# Altium project mixed_audio_board.PrjPcb (part 1 of 2)
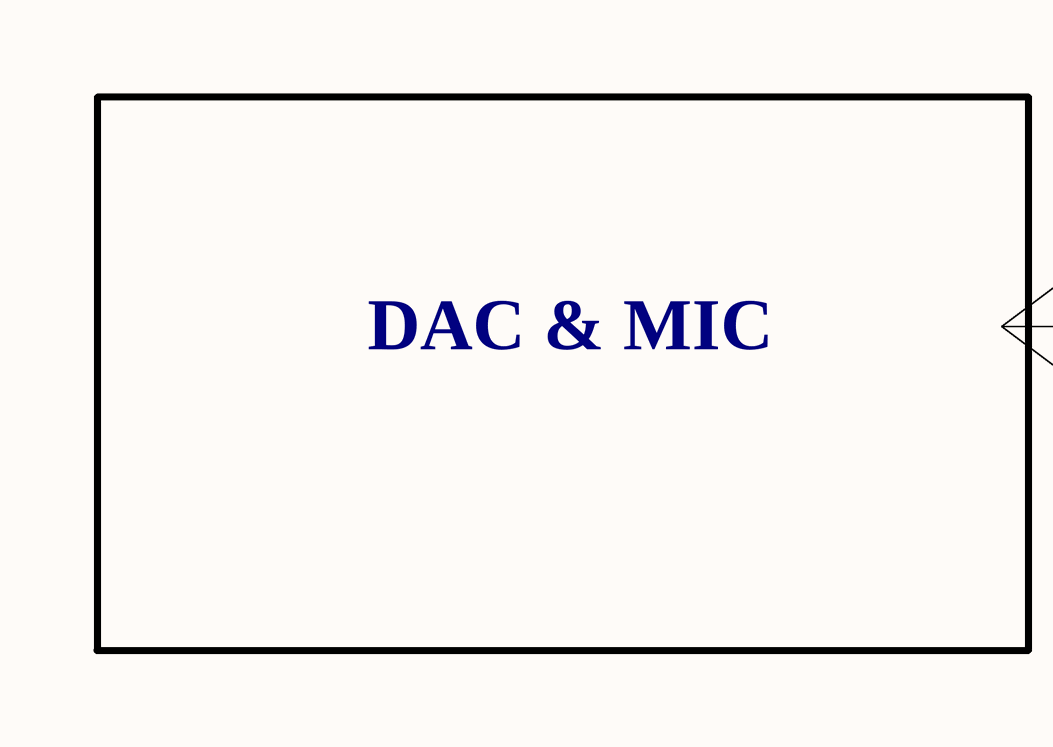
[diagram p0: [1]block_diagram.SchDoc, top left]
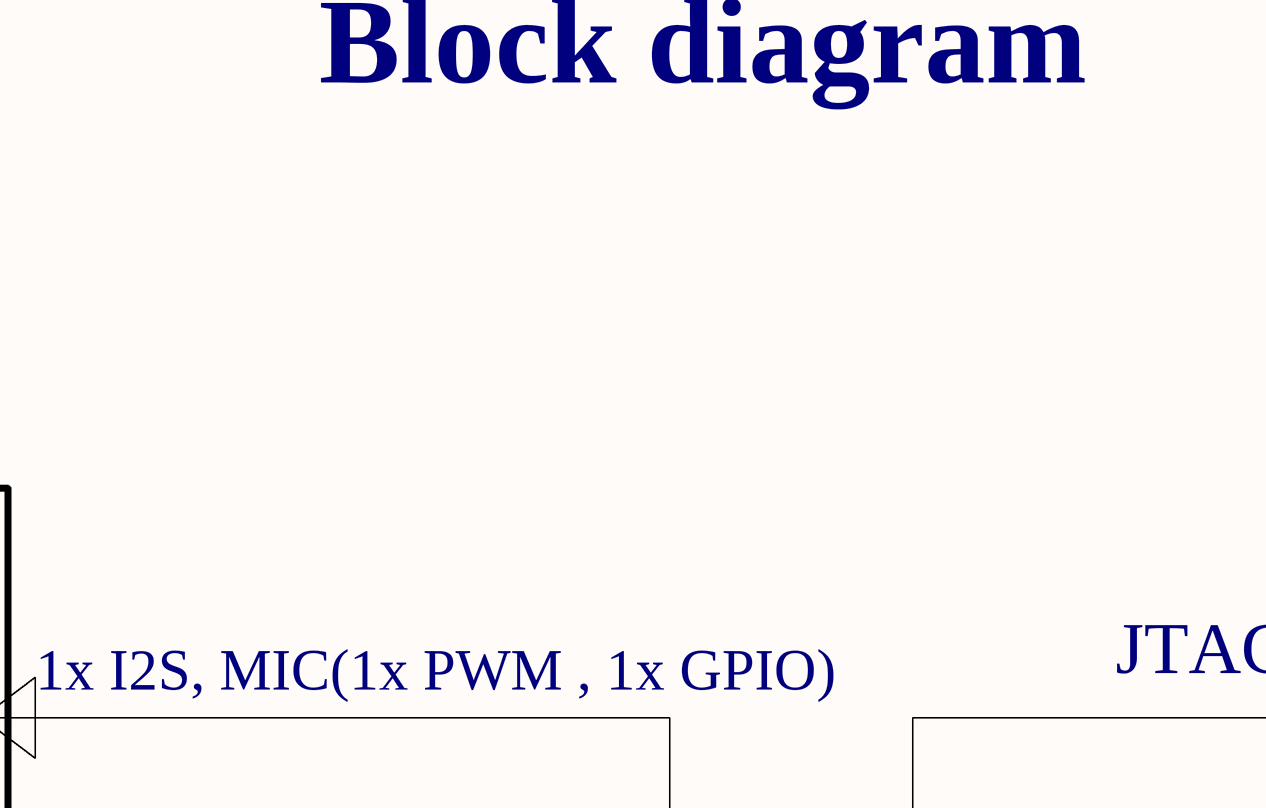
[diagram p1: [1]block_diagram.SchDoc, top middle]
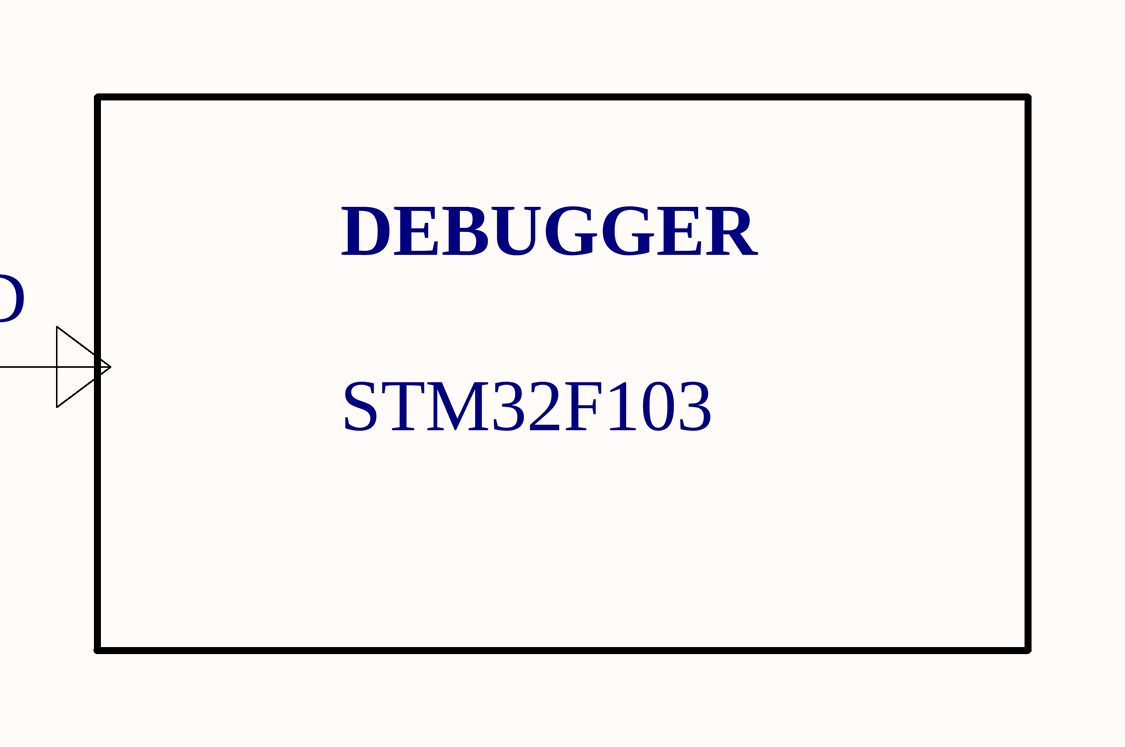
[diagram p2: [1]block_diagram.SchDoc, top right]
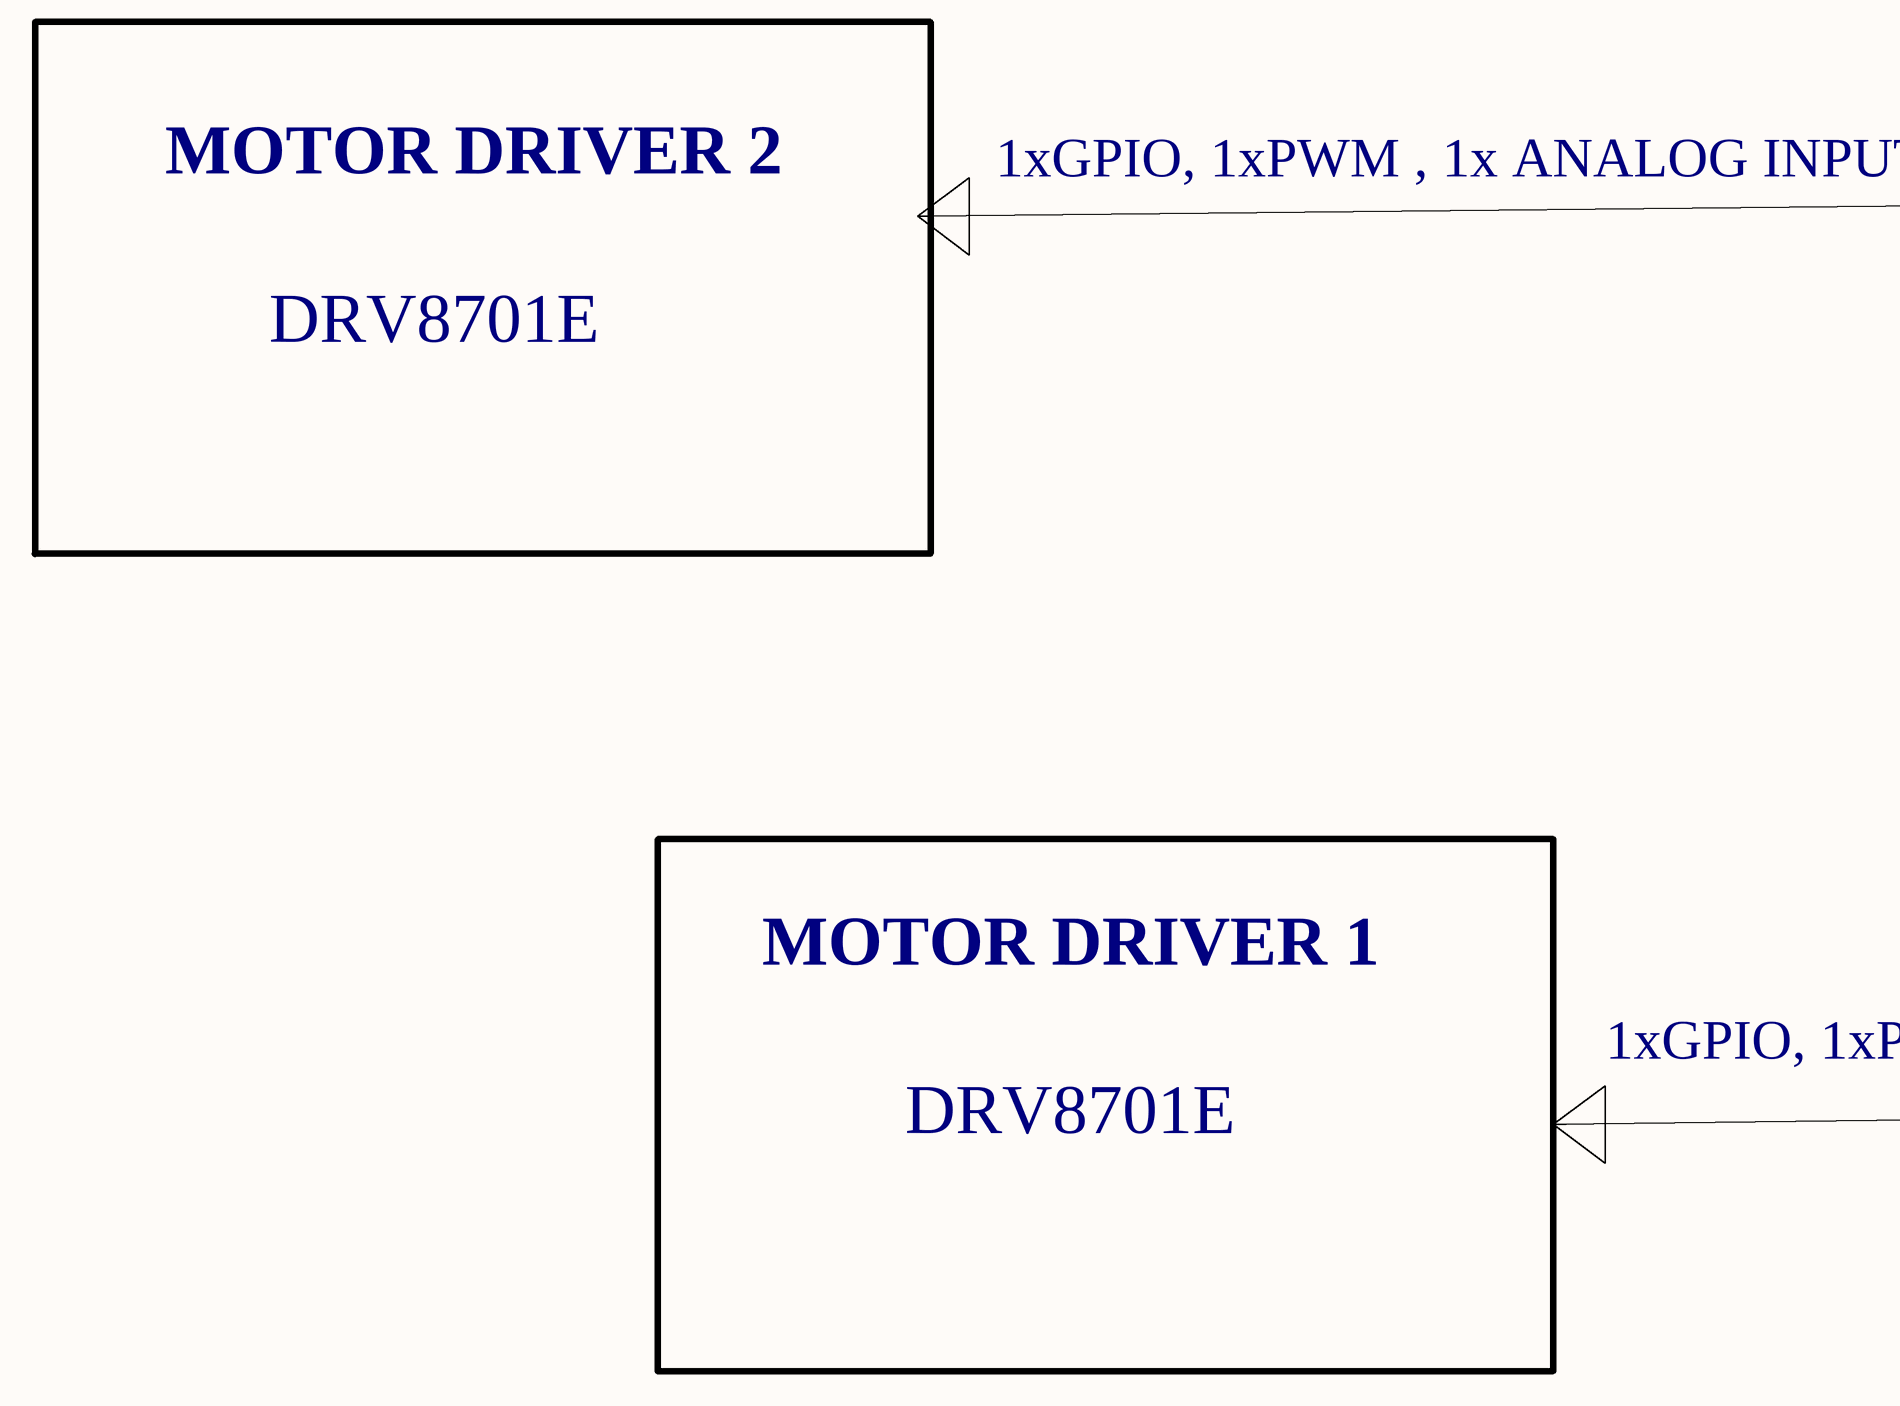
[diagram p3: [1]block_diagram.SchDoc, bottom left]
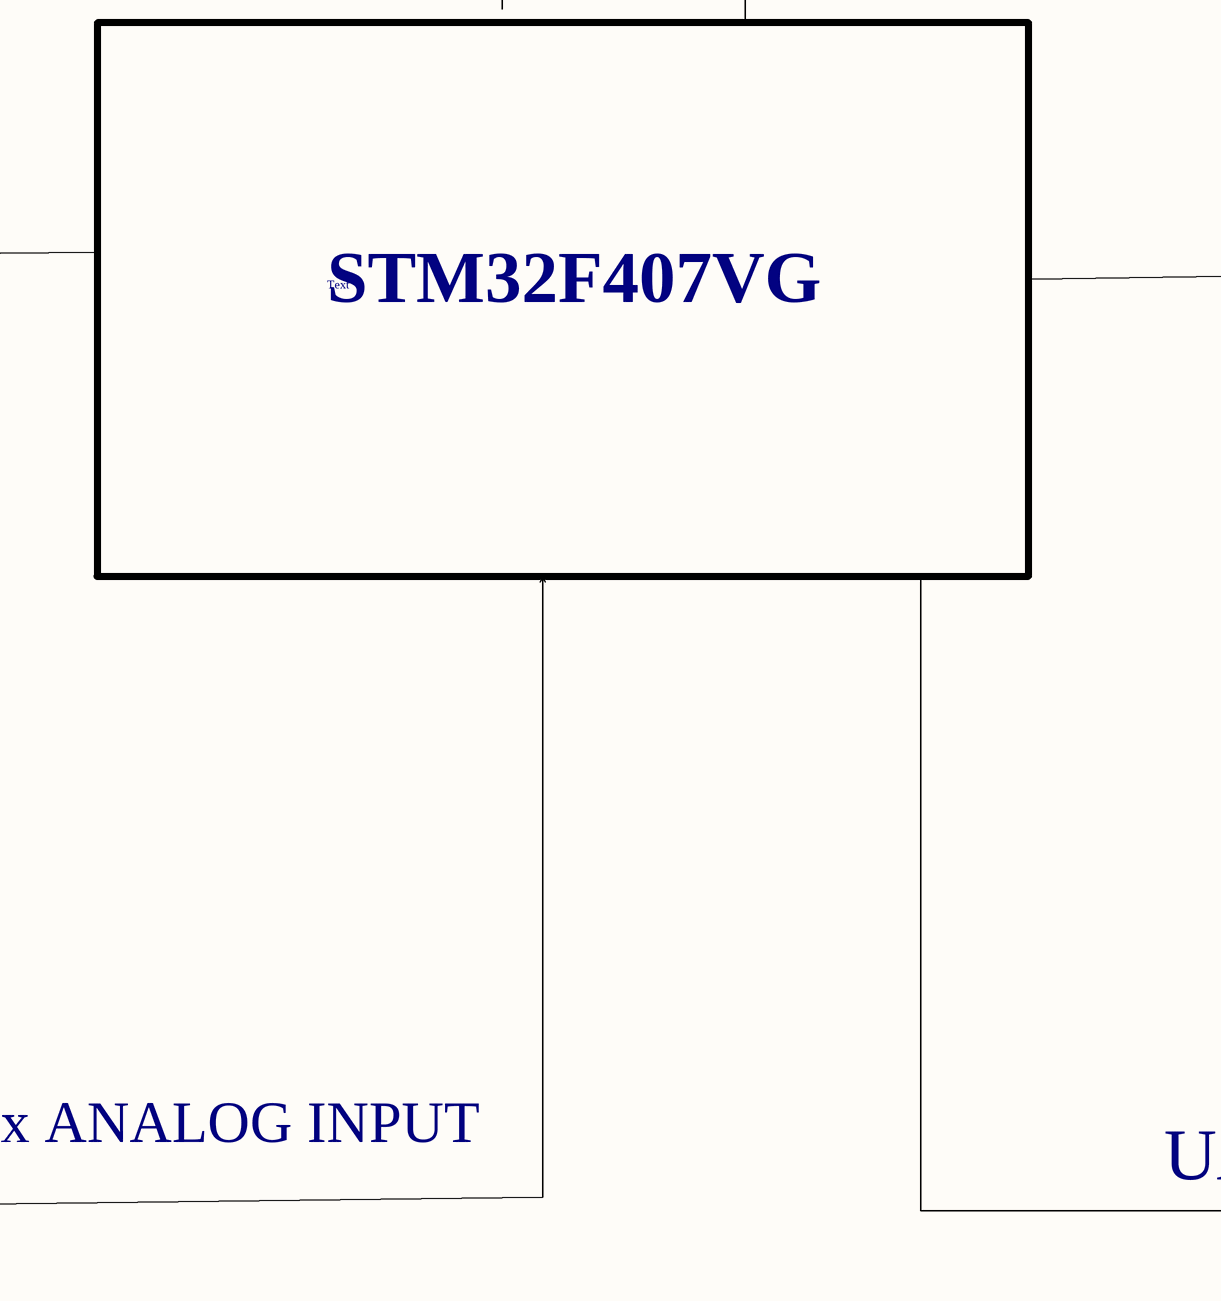
[diagram p4: [1]block_diagram.SchDoc, bottom middle]
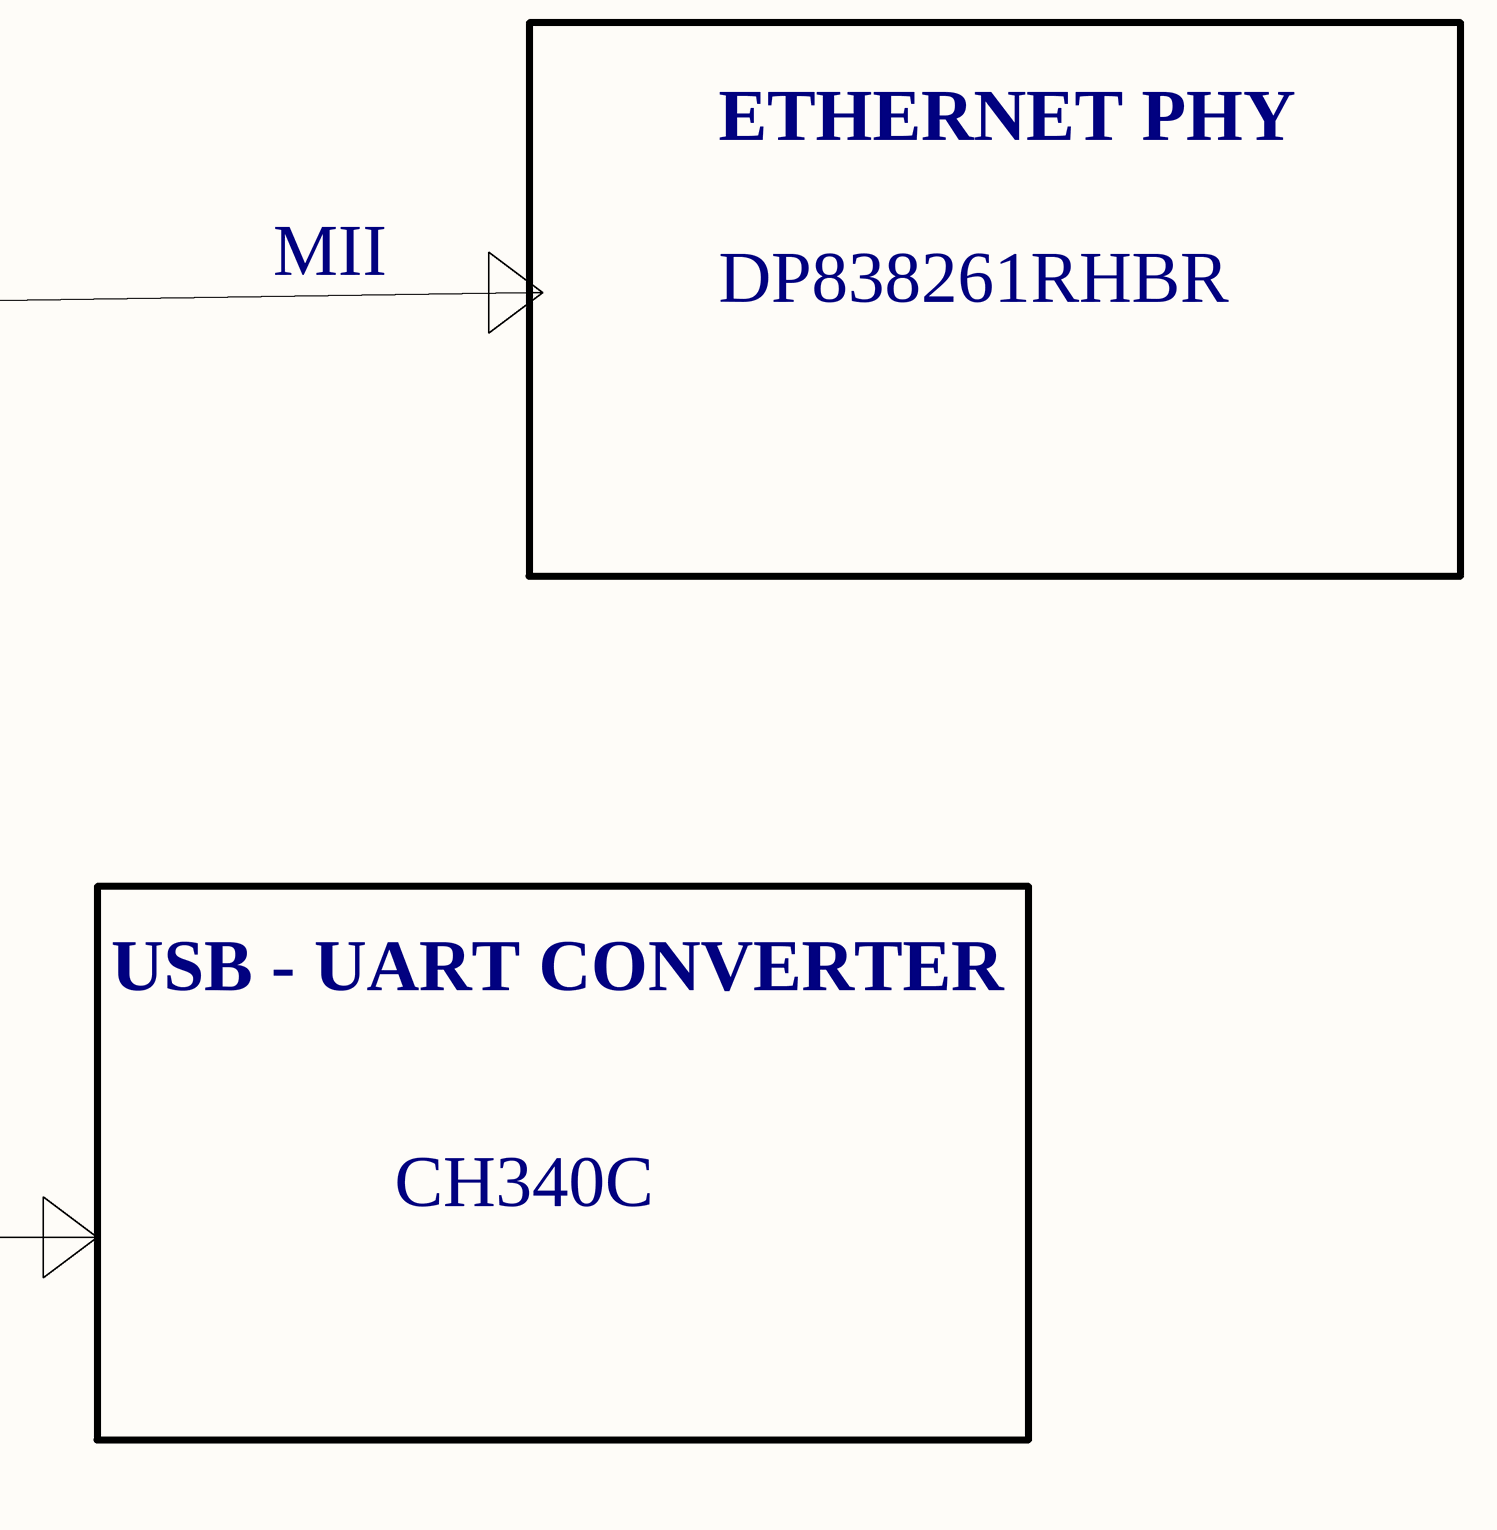
[diagram p5: [1]block_diagram.SchDoc, bottom right]
11 sheets, 188 parts. Net scope: flat (ports and power ports of the same name join across sheets).
Board file: mixed_audio_board.PcbDoc
Sheets:
  [1]block_diagram.SchDoc
  [2]Power_budget.SchDoc
  [3]STM32F103_Debugger.SchDoc
  [4]Ethernet_PHY.SchDoc
  [5]Motor_Driver.SchDoc
  [6]CH340C.SchDoc
  [7]DAC_and_MIC.SchDoc
  [8]ADC_chip.SchDoc
  [9]STM32F407_Controller.SchDoc
  [10]Motor_Driver_2.SchDoc
  [11]power_input_and_regualtors.SchDoc

## Sheet [1]block_diagram.SchDoc
size A0; DocumentNumber: 1; SheetNumber: 1; SheetTotal: 11

### Notes on the sheet
- Block diagram
- DEBUGGER
- 1x I2S, MIC(1x PWM , 1x GPIO)
- JTAG/SWD
- DAC & MIC
- STM32F103
- ETHERNET PHY
- MOTOR DRIVER 2
- 1xGPIO, 1xPWM , 1x ANALOG INPUT
- Text
- STM32F407VG
- MII
- DP838261RHBR
- DRV8701E
- USB - UART CONVERTER
- MOTOR DRIVER 1
- UART
- CH340C
- Title
- Size:
- Date:
- File:
- A0
- Number:
- Time:
- Revision:
- Sheet
- of

## Sheet [2]Power_budget.SchDoc
size A0; DocumentNumber: 2; SheetNumber: 2; SheetTotal: 11
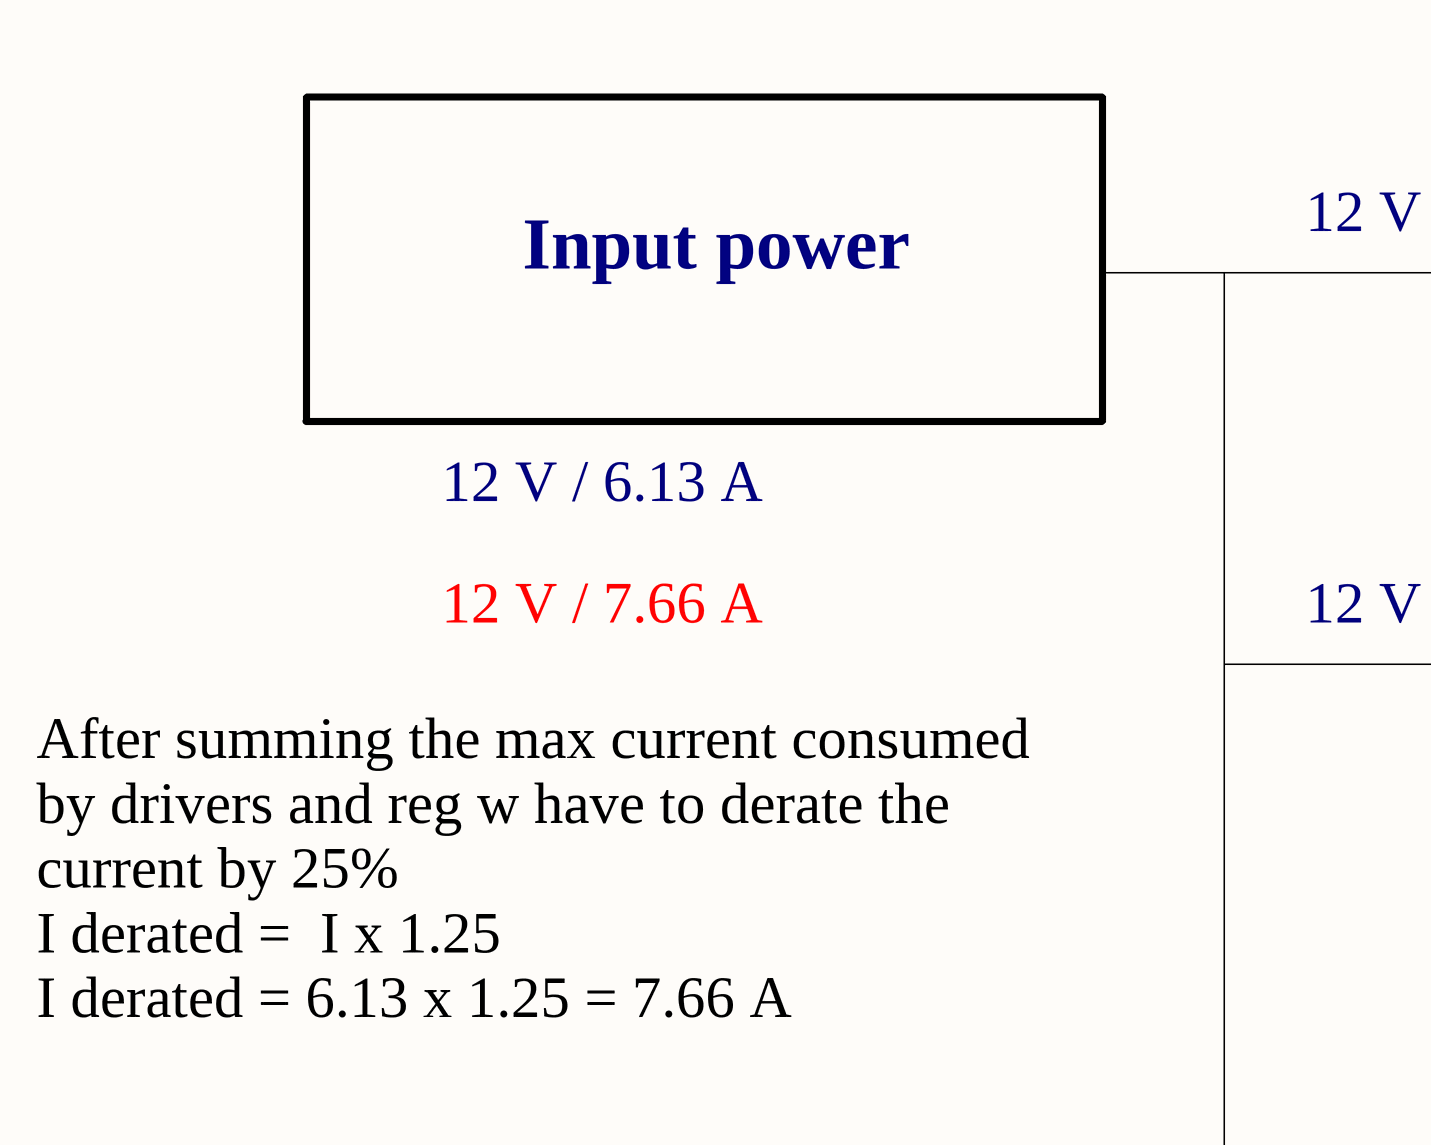
[diagram p6: [2]Power_budget.SchDoc, top left]
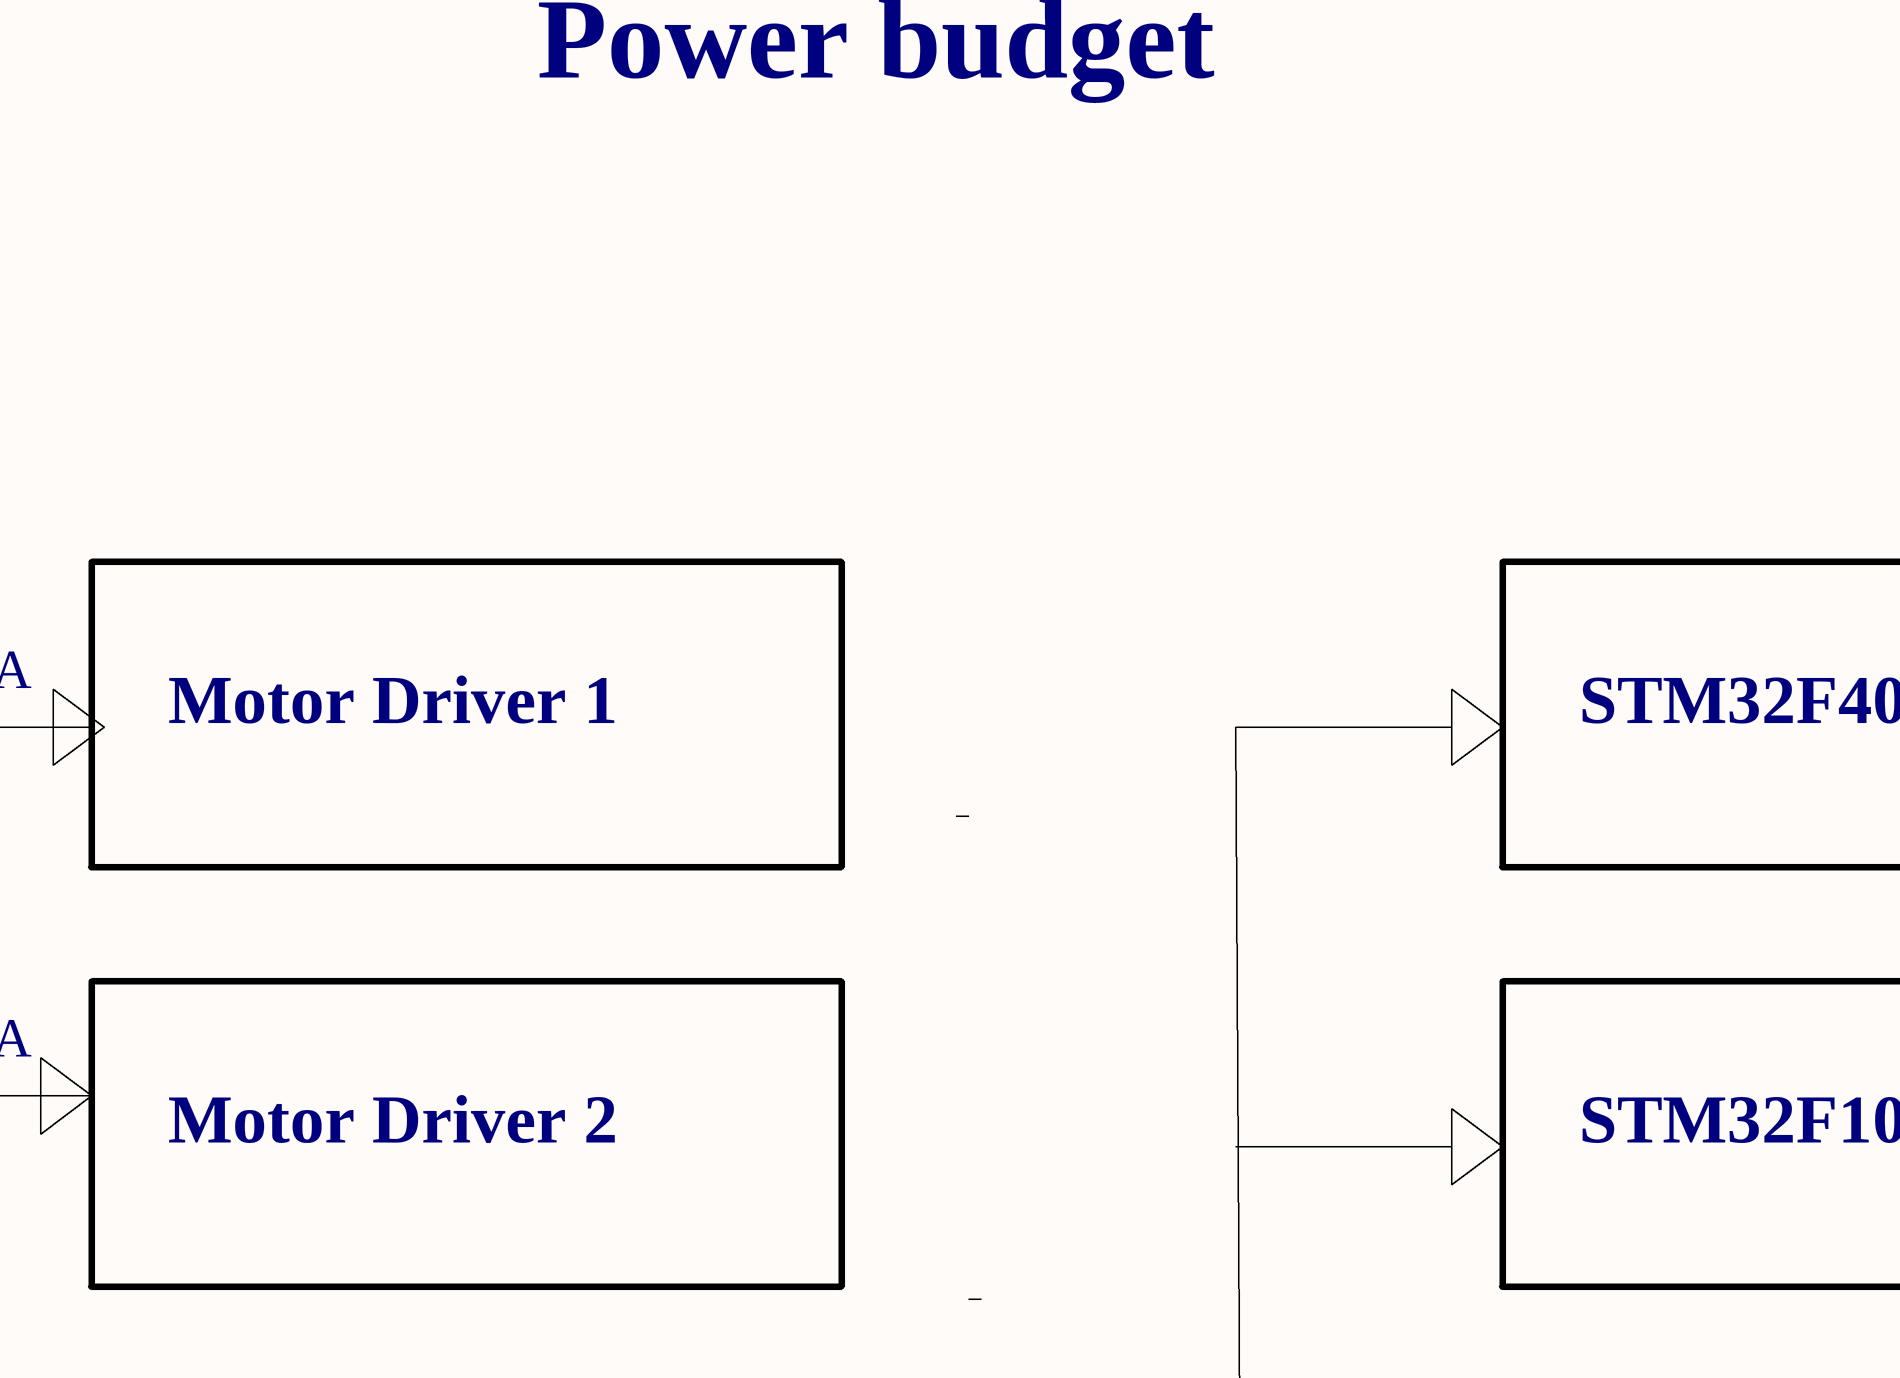
[diagram p7: [2]Power_budget.SchDoc, top middle]
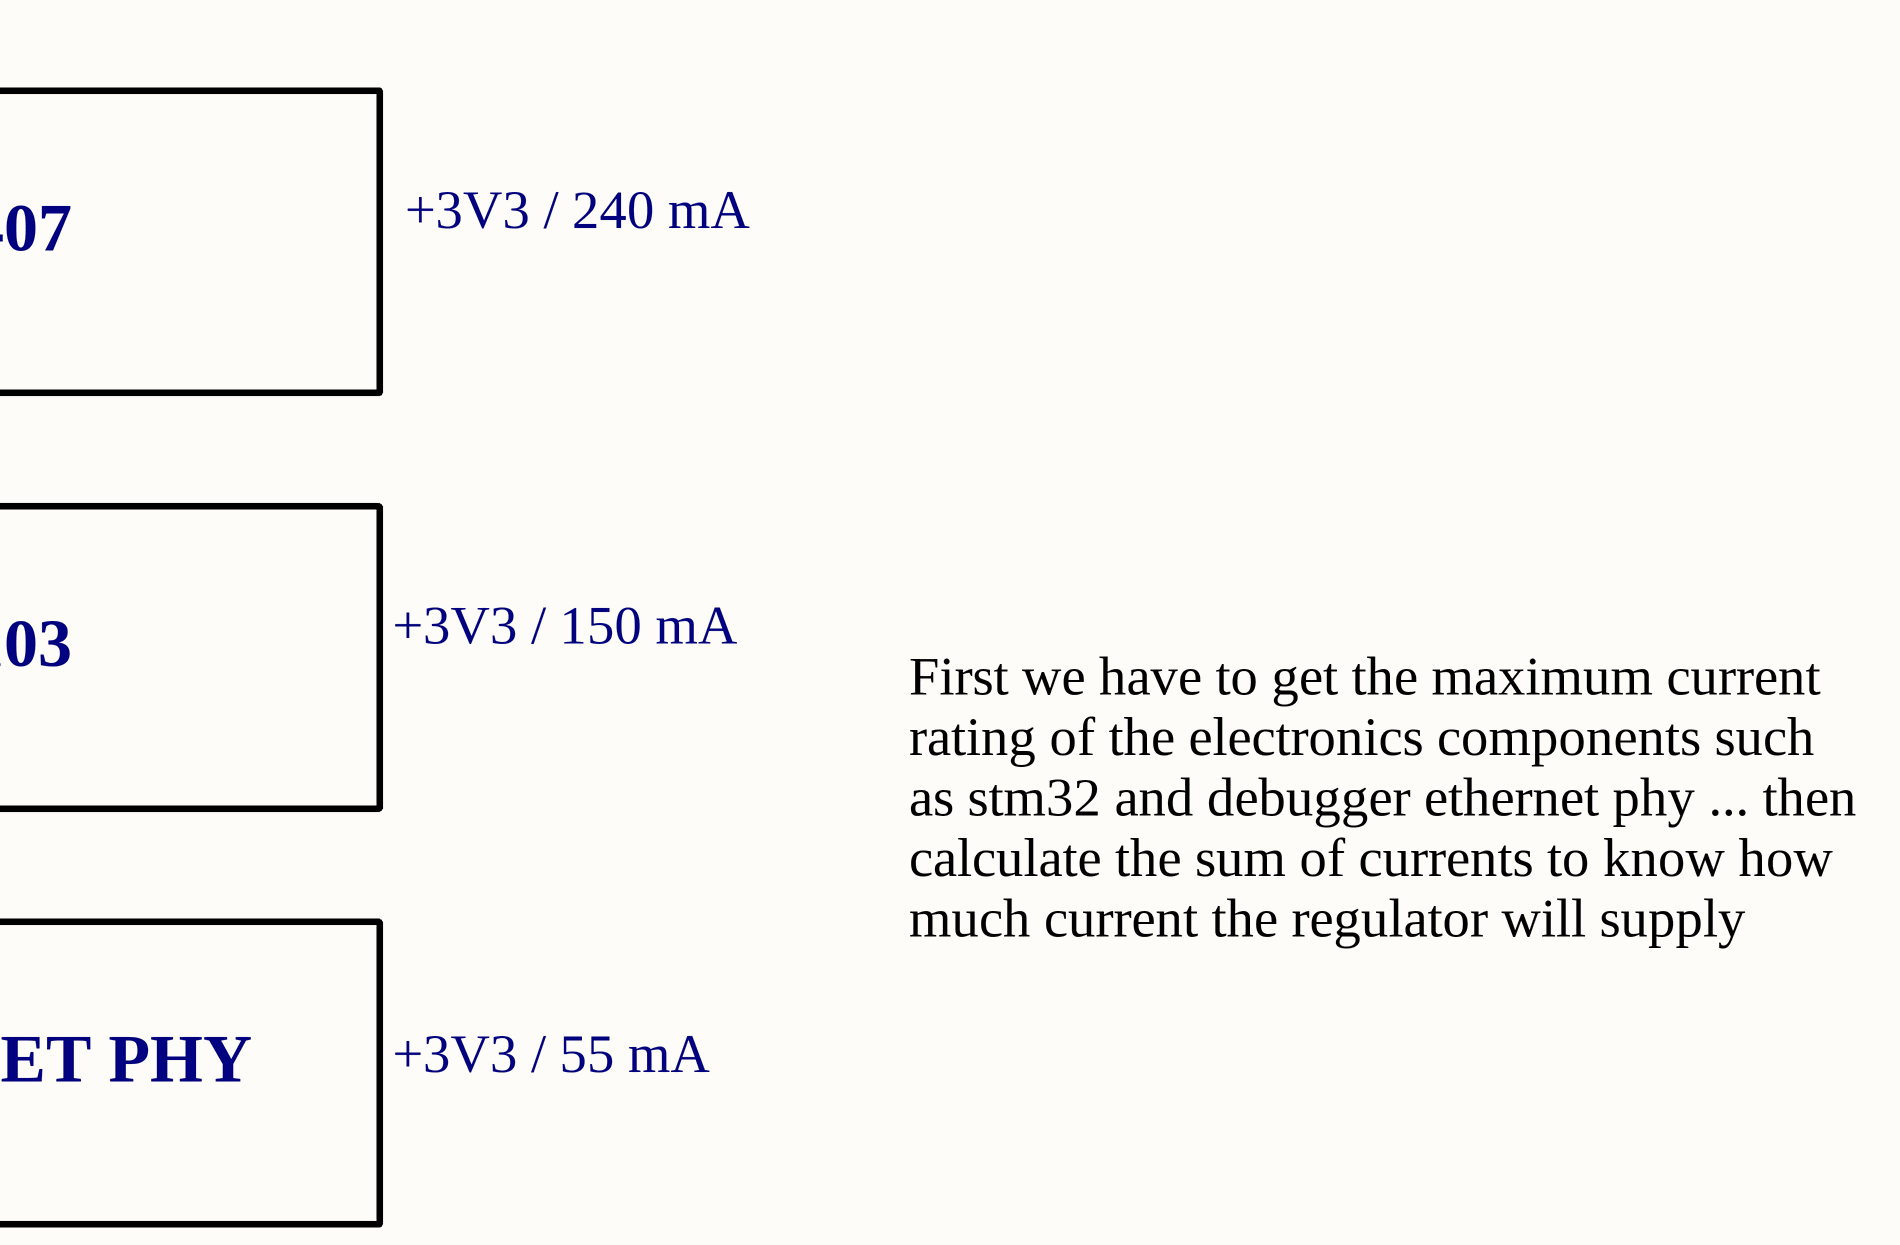
[diagram p8: [2]Power_budget.SchDoc, top right]
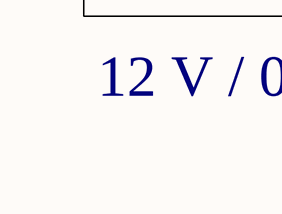
[diagram p9: [2]Power_budget.SchDoc, bottom left]
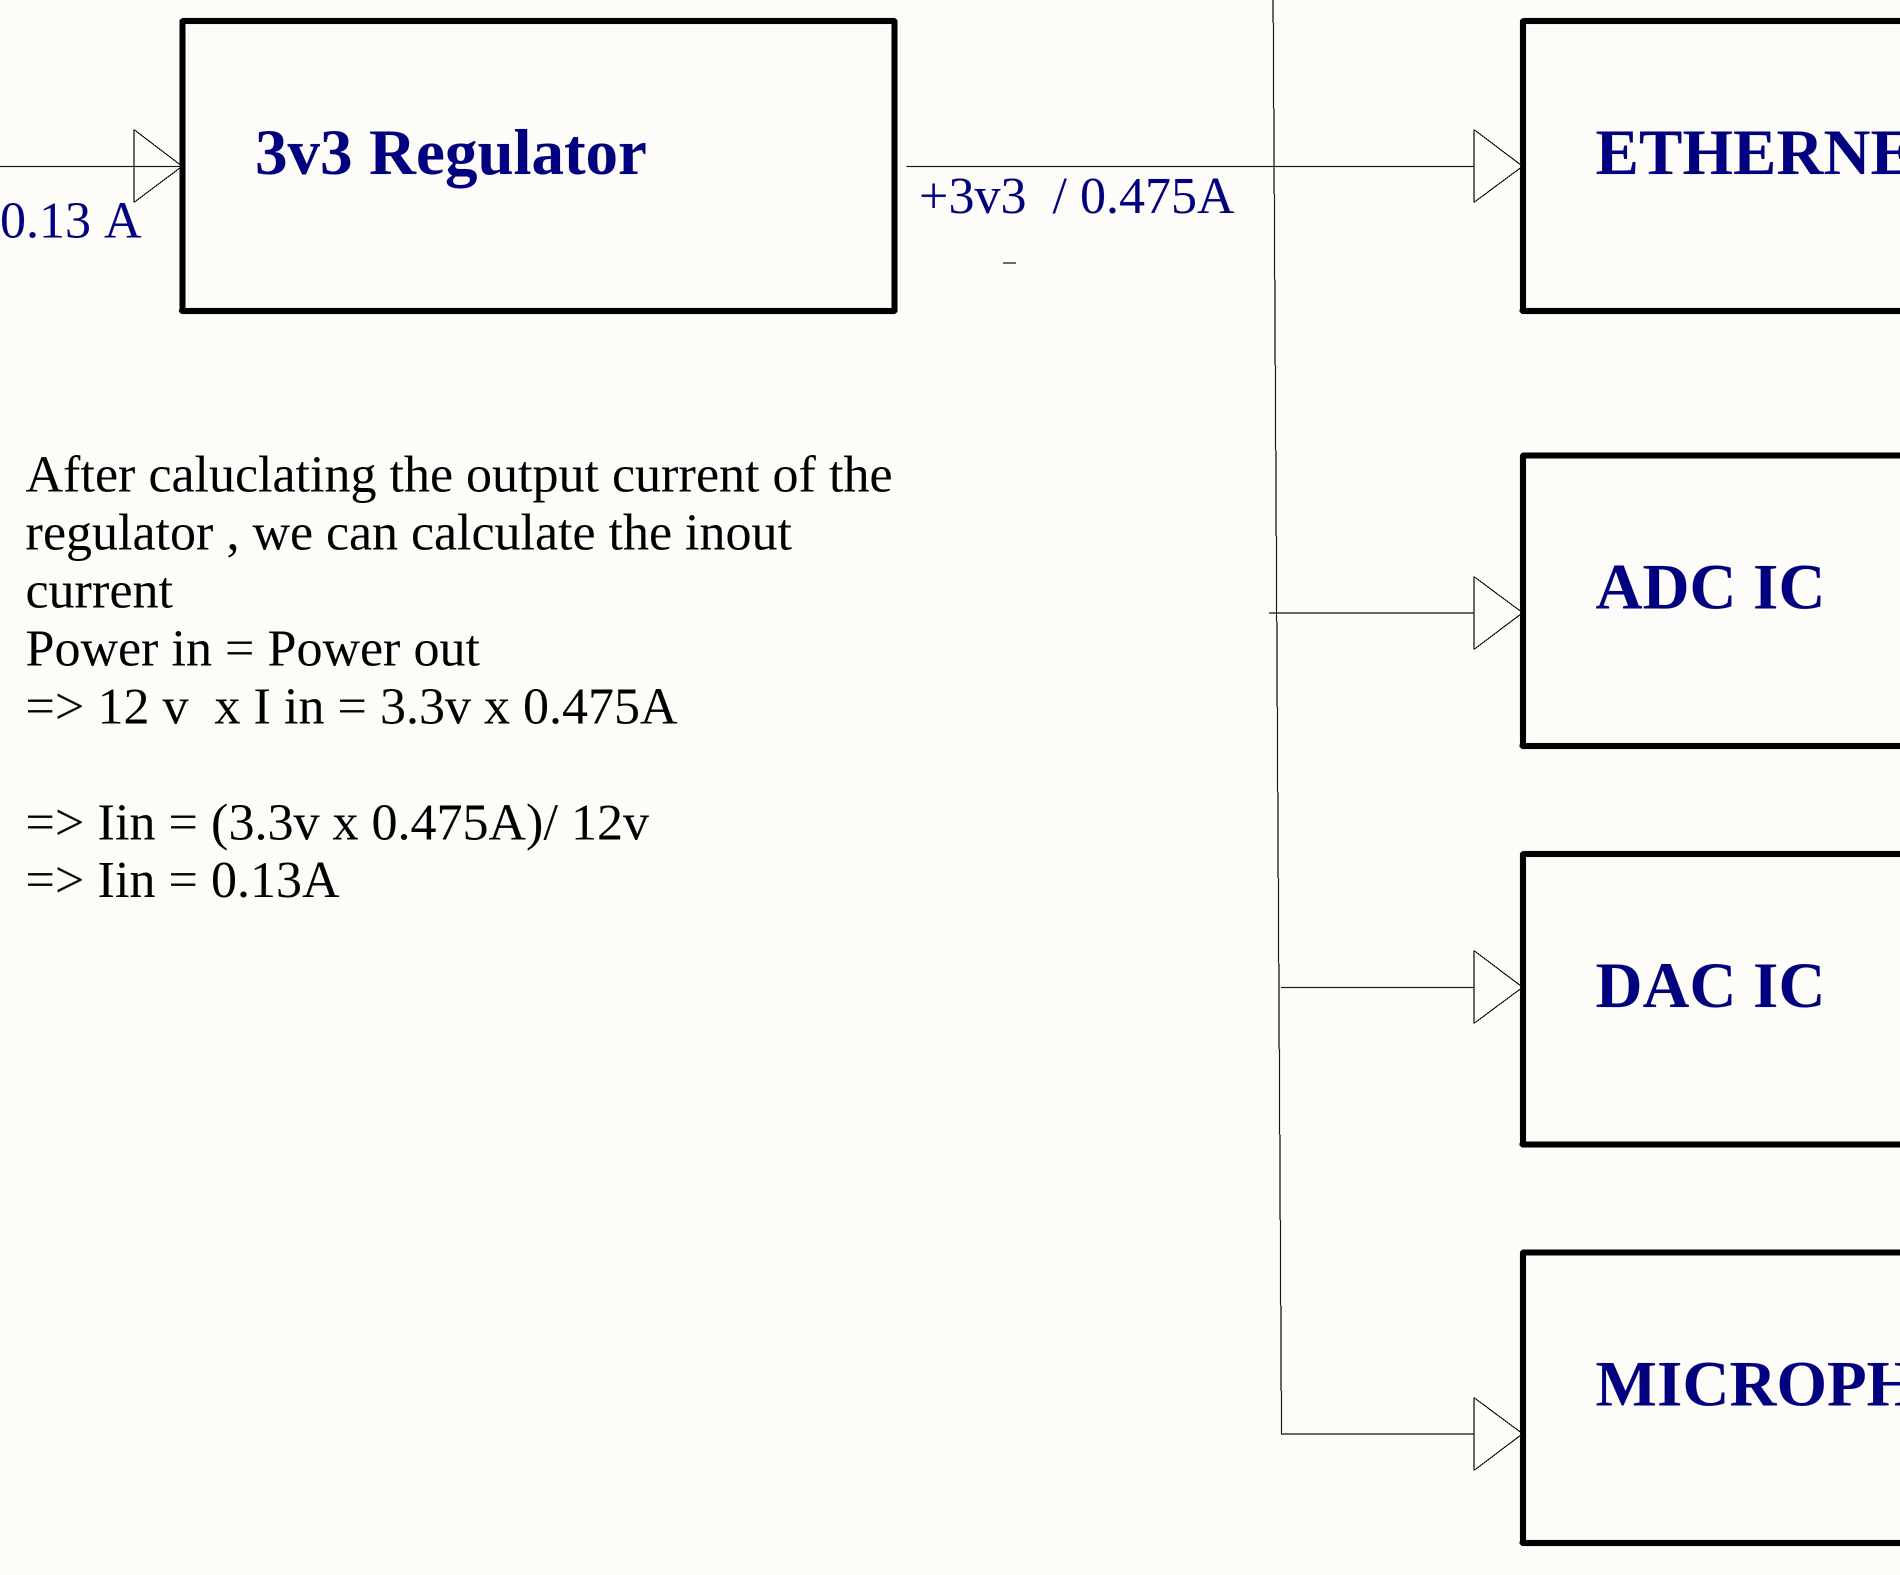
[diagram p10: [2]Power_budget.SchDoc, bottom middle]
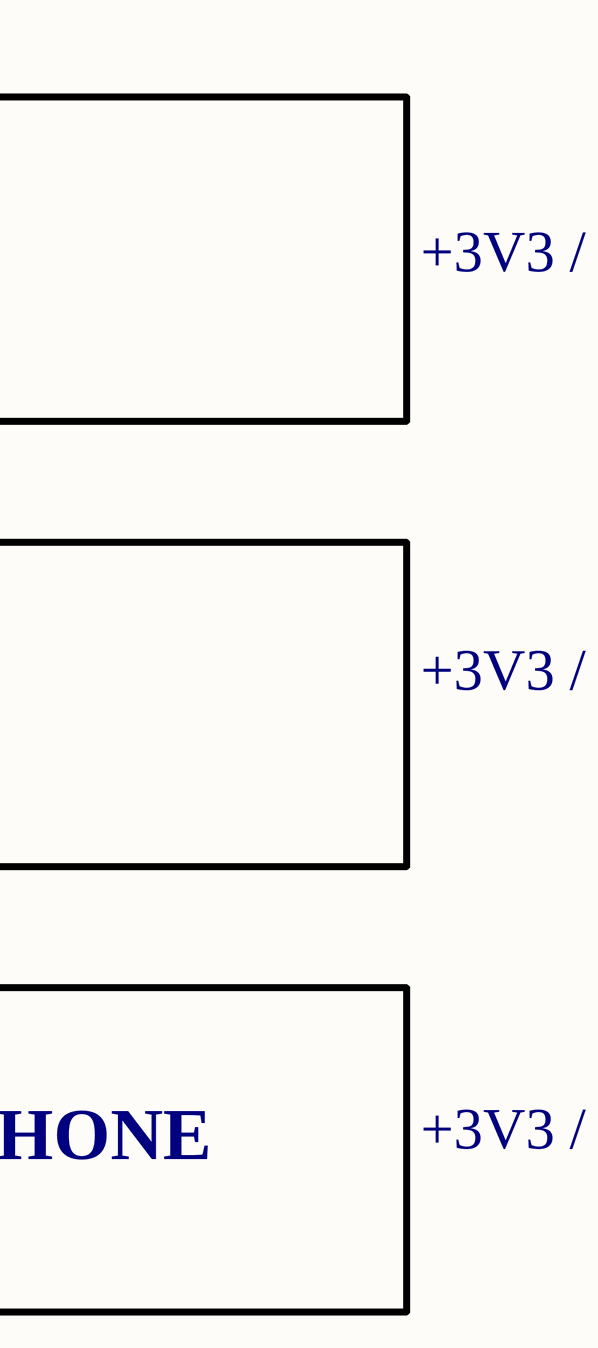
[diagram p11: [2]Power_budget.SchDoc, bottom right]

### Notes on the sheet
- Power budget
- 12 V / 3A
- Input power
- Motor Driver 1
- STM32F407
- +3V3 / 240 mA
- 12 V / 6.13 A
- 12 V / 7.66 A
- +3V3 / 150 mA
- Motor Driver 2
- STM32F103
- After summing the max current consumed by drivers and reg w have to derate the current by 25%
  I derated =  I x 1.25
  I derated = 6.13 x 1.25 = 7.66 A
- First we have to get the maximum current rating of the electronics components such as stm32 and debugger ethernet phy ... then calculate the sum of currents to know how much current the regulator will supply
- 3v3 Regulator
- ETHERNET PHY
- +3V3 / 55 mA
- 12 V / 0.13 A
- +3v3  / 0.475A
- ADC IC
- +3V3 / 10 mA
- After caluclating the output current of the regulator , we can calculate the inout current
  Power in = Power out
  => 12 v  x I in = 3.3v x 0.475A
  => Iin = (3.3v x 0.475A)/ 12v
  => Iin = 0.13A
- DAC IC
- MICROPHONE
- Title
- Size:
- Date:
- File:
- A0
- Number:
- Time:
- Revision:
- Sheet
- of

## Sheet [3]STM32F103_Debugger.SchDoc
size A3; DocumentNumber: 3; SheetNumber: 3; SheetTotal: 11
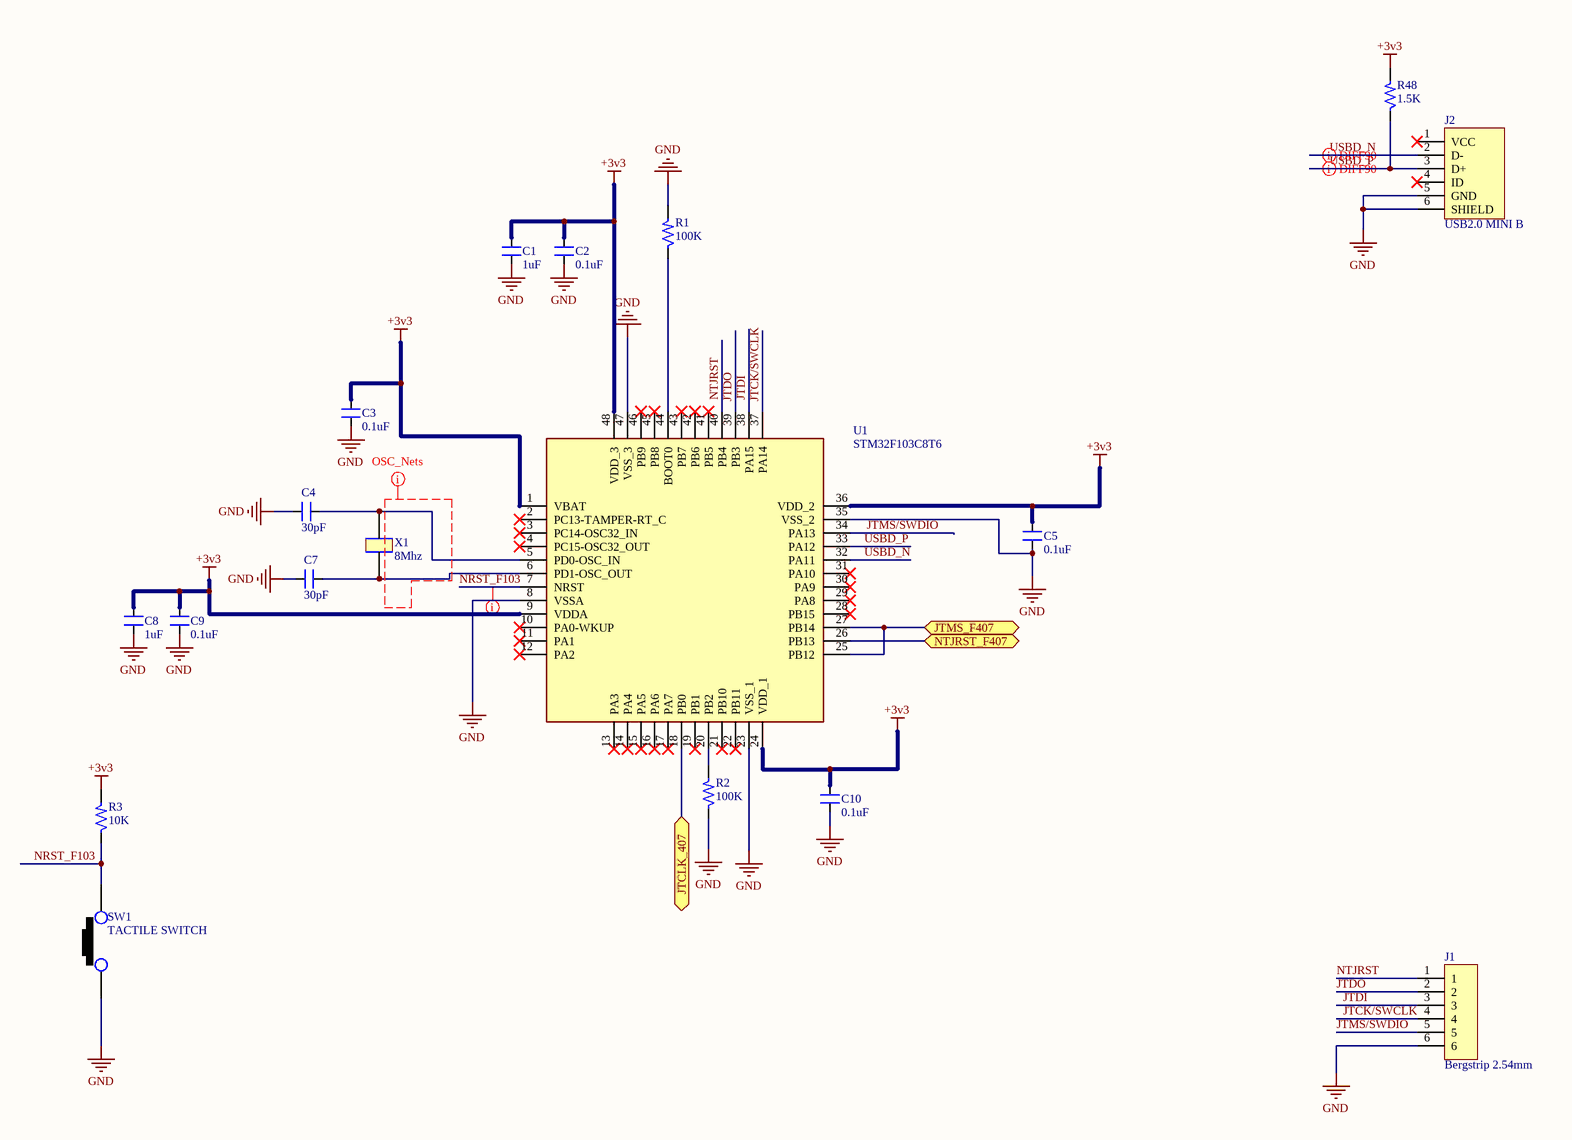
[diagram p12: [3]STM32F103_Debugger.SchDoc]

### Parts
C1  1uF  [CAP_0805]
C2  0.1uF  [CAP_0805]
C3  0.1uF  [CAP_0805]
C4  30pF  [CAP_0805]
C5  0.1uF  [CAP_0805]
C7  30pF  [CAP_0805]
C8  1uF  [CAP_0805]
C9  0.1uF  [CAP_0805]
C10  0.1uF  [CAP_0805]
J1  Bergstrip 2.54mm  [CON6_100_59D78_TH_ST]
J2  USB2.0 MINI B  [CON_690-005-299-043]
R1  100K  [RES_0805]
R2  100K  [RES_0805]
R3  10K  [RES_0805]
R48  1.5K  [RES_0805]
SW1  TACTILE SWITCH  [SW_342_SMD]
U1  STM32F103C8T6  [LQFP-48_19.6_393_58X11_SMD]
X1  8Mhz  [XTAL_314_240X47_SMD]

### Ports
JTCLK_407 (bidir), JTMS_F407 (bidir), NTJRST_F407 (bidir)

### Nets
+3v3: C1.1 C2.2 C3.2 C5.2 C8.1 C9.2 C10.2 R3.2 R48.2 U1.1(VBAT) U1.9(VDDA) U1.24(VDD_1) U1.36(VDD_2) U1.48(VDD_3)
GND: C1.2 C2.1 C3.1 C4.1 C5.1 C7.1 C8.2 C9.1 C10.1 J1.6 J2.5(GND) J2.6(SHIELD) R1.2 R2.1 SW1.1 U1.8(VSSA) U1.23(VSS_1) U1.35(VSS_2) U1.47(VSS_3)
JTCK/SWCLK: J1.4 U1.37(PA14)
JTDI: J1.3 U1.38(PA15)
JTDO: J1.2 U1.39(PB3)
JTMS/SWDIO: J1.5 U1.34(PA13)
NRST: U1.26(PB13) ; port NTJRST_F407
NRST_F103: R3.1 SW1.2 U1.7(NRST)
NTJRST: J1.1 U1.40(PB4)
USBD_N: J2.2(D-) U1.32(PA11)
USBD_P: J2.3(D+) R48.1 U1.33(PA12)
NetC4_2: C4.2 U1.5(PD0-OSC_IN) X1.2
NetC7_2: C7.2 U1.6(PD1-OSC_OUT) X1.1
NetR1_1: R1.1 U1.44(BOOT0)
NetR2_2: R2.2 U1.20(PB2)
NetU1_18: U1.18(PB0) ; port JTCLK_407
NetU1_25: U1.25(PB12) U1.27(PB14) ; port JTMS_F407

Not connected (* = marked no-connect by the designer): J2 1(VCC)* 4(ID)*; U1 2(PC13-TAMPER-RT_C)* 3(PC14-OSC32_IN)* 4(PC15-OSC32_OUT)* 10(PA0-WKUP)* 11(PA1)* 12(PA2)* 13(PA3)* 14(PA4)* 15(PA5)* 16(PA6)* 17(PA7)* 19(PB1)* 21(PB10)* 22(PB11)* 28(PB15)* 29(PA8)* 30(PA9)* 31(PA10)* 41(PB5)* 42(PB6)* 43(PB7)* 45(PB8)* 46(PB9)*

### Layout directives
differential pair; differential pair class DIFF90: USBD_N, USBD_P
net class Critical nets: NRST_F103
net class OSC_Nets: (no net found under the mark)

### Notes on the sheet
- Title
- Size:
- Date:
- A3
- Number:
- Time:
- Revision:
- Sheet
- of
- File:

### Library data of the parts
C1 C8 = CAP_1uF-50V-5%-0805: 1µF ±5% 50V Ceramic Capacitor X7R 0805 (2012 Metric) /; Manufacturer: Samsung; Manufacturer Part Number: CC0805JKX7R9BB105; Alternate Part Number-1: 0805F105M500NT; Case/Package: 0805; Supplier-1: SIRICOM; Supplier Part Number-1: CL21B105KBFNNNE
C2 C3 C5 C9 C10 = CAP_0.1uF-50V-5%-0805: 0.1µF ±5% 50V Ceramic Capacitor X7R 0805 (2012 Metric) /; Manufacturer: AVX Corporation; Manufacturer Part Number: 08055C104JAT4A; Alternate Part Number-1: 0805B104M500; Case/Package: 0805; Supplier-1: SIRICOM; Supplier Part Number-1: 0805B104J500CT
C4 C7 = CAP_30pF-50V-10%-0805: ±10% 50V Ceramic Capacitor C0G, NP0 0805 (2012 Metric) /; Manufacturer Part Number: C0805C300K5GAC7800; Manufacturer: KEMET; Alternate Part Number: NA; Case/Package: 0805; Supplier-1: Digikey; Supplier Part Number-1: 399-17443-1-ND - Cut Tape (CT)
J1 = CON-BS-SKT_6X1-100-ST-TH: 6 Pins, 1 Row 2.54mm Pitch, Straight bergstrip, Female; Manufacturer: Molex; Alternate Part Number-1: NA; Manufacturer Part Number: 22-10-2061; Case/Package: TH-CON; Supplier-1: SP ROAD; Supplier Part Number-1: NA
J2 = CON_USB2.0-MINIB-SMD: USB - mini B USB 2.0 Receptacle Connector 5 Position Surface Mount, Right Angle; Manufacturer: EDAC; Manufacturer Part Number: 690-005-299-043; Alternate Part Number-1: NA; Case/Package: USB-MINI-B; Supplier-1: LCSC; Supplier Part Number-1: C105424
R1 R2 = RES_100K-0.125W-1%-0805: 100 kOhms ±1% 0.125W, 1/8W Chip Resistor 0805 (2012 Metric) Automotive AEC-Q200 Thick Film /; Manufacturer: Walsin; Manufacturer Part Number: WR08X1003FTL; Alternate Part Number-1: NA; Case/Package: 0805; Supplier-1: SIRICOM; Supplier Part Number-1: WR08X1003FTL
R3 = RES_10K-0.125W-1%-0805: 10 kOhms ±1% 0.125W, 1/8W Chip Resistor 0805 (2012 Metric) Automotive AEC-Q200 Thick Film /; Manufacturer: CTS; Manufacturer Part Number: WR08X1002FTL; Case/Package: 0805; Supplier-1: SIRICOM; Supplier Part Number-1: WR08X1002FTL; Alternate Part Number-1: WR08X1002FTL
R48 = RES_1.5K-0.125W-1%-0805: 1.5 kOhms ±1% 0.125W, 1/8W Chip Resistor 0805 (2012 Metric) Thick Film /; Manufacturer: TE Connectivity Passive Product; Manufacturer Part Number: CRG0805F1K5; Alternate Part Number-1: NA; Case/Package: 0805; Supplier-1: SIRICOM; Supplier Part Number-1: NA
SW1 = SW1_RS-282G05A3-SMRT-SMD: Tactile Switch SPST-NO Top Actuated Surface Mount; Manufacturer: ITT C&K; Alternate Part Number-1: NA; Manufacturer Part Number: RS-282G05A3-SMRT; Case/Package: SMD; Supplier-1: SP ROAD; Supplier Part Number-1: RS-282G05A3-SMRT
U1 = IC_STM32F103C8T6: ARM® Cortex®-M3 STM32F1 Microcontroller IC 32-Bit 72MHz 64KB (64K x 8) FLASH 48-LQFP (7x7) /; Manufacturer: STMicroelectronics; Alternate Part Number-1: NA; Manufacturer Part Number: STM32F103C8T6; Case/Package: LQFP48; Supplier-1: LCSC; Supplier Part Number-1: STM32F103C8T6
X1 = XTAL_8MHZ-ECS-80-32-5PX-SMD: 8MHz ±30ppm Crystal 32pF 60 Ohms HC-49/US /; Manufacturer: Fox Electronics; Manufacturer Part Number: ECS-80-32-5PX-TR; Alternate Part Number-1: NA; Case/Package: SMD/SMT; Supplier-1: SP ROAD; Supplier Part Number-1: ECS-80-32-5PX-TR

## Sheet [4]Ethernet_PHY.SchDoc
size A3; DocumentNumber: 4; SheetNumber: 4; SheetTotal: 11
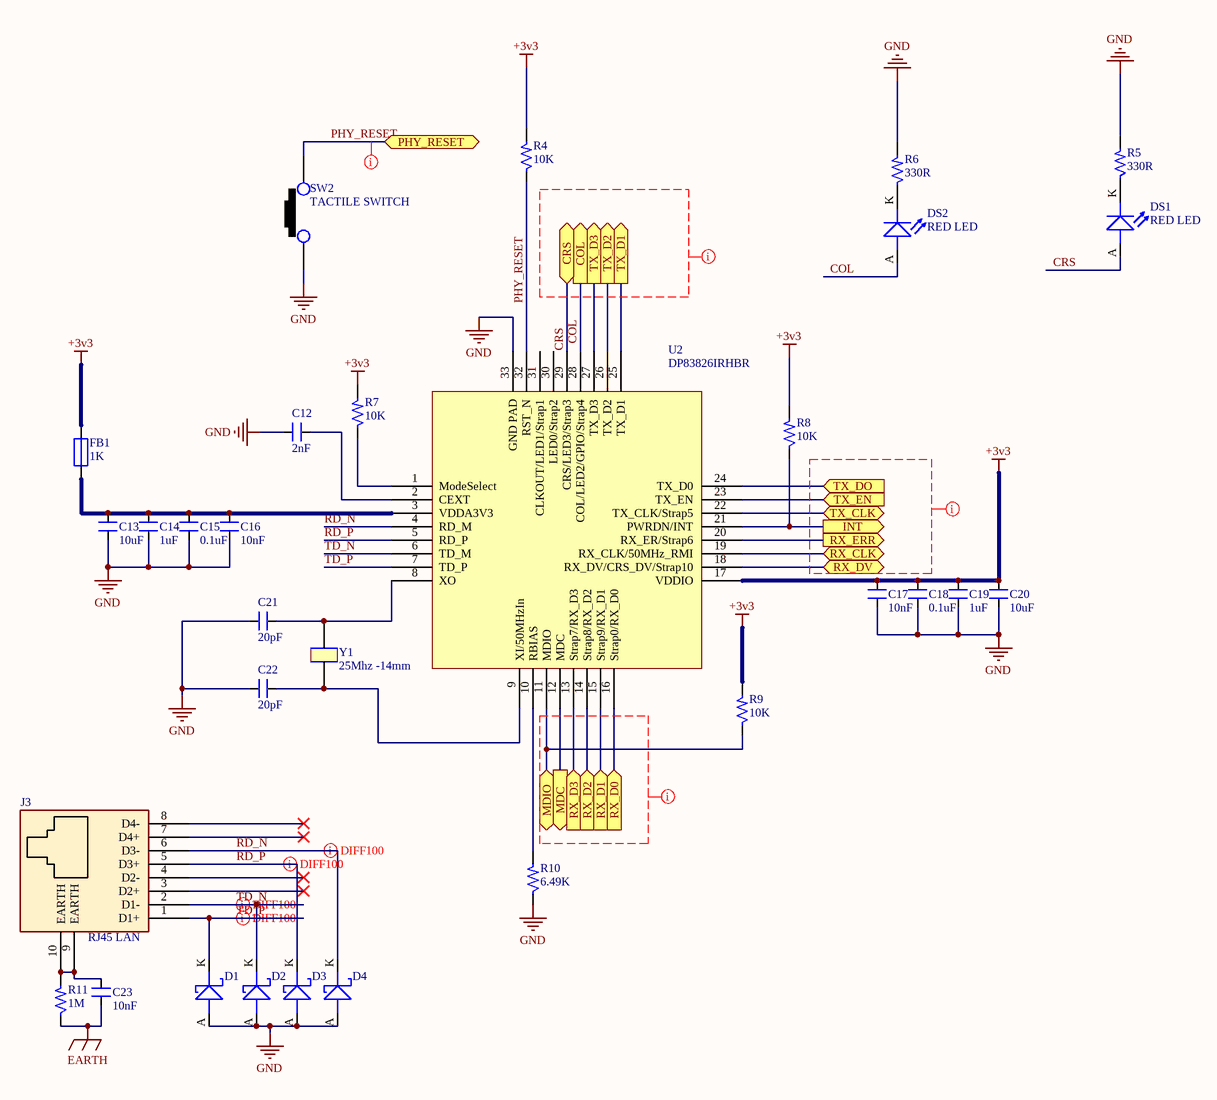
[diagram p13: [4]Ethernet_PHY.SchDoc]

### Parts
C12  2nF  [CAP_0805]
C13  10uF  [CAP_1206]
C14  1uF  [CAP_0805]
C15  0.1uF  [CAP_0805]
C16  10nF  [CAP_0805]
C17  10nF  [CAP_0805]
C18  0.1uF  [CAP_0805]
C19  1uF  [CAP_0805]
C20  10uF  [CAP_1206]
C21  20pF  [CAP_0805]
C22  20pF  [CAP_0805]
C23  10nF  [CAP_P196_102X287_H332_RAD_TH]
D1  ESD3V3D9-TP  [DIO_SOD-923]  (value not drawn)
D2  ESD3V3D9-TP  [DIO_SOD-923]  (value not drawn)
D3  ESD3V3D9-TP  [DIO_SOD-923]  (value not drawn)
D4  ESD3V3D9-TP  [DIO_SOD-923]  (value not drawn)
DS1  RED LED  [LED_0805]
DS2  RED LED  [LED_0805]
FB1  1K  [IND_0805]
J3  RJ45 LAN  [CON10_P106_RJ45_TH_ST]
R4  10K  [RES_0805]
R5  330R  [RES_0805]
R6  330R  [RES_0805]
R7  10K  [RES_0805]
R8  10K  [RES_0805]
R9  10K  [RES_0805]
R10  6.49K  [RES_0805]
R11  1M  [RES_0805]
SW2  TACTILE SWITCH  [SW_342_SMD]
U2  DP83826IRHBR  [VQFN32_19_218_23X9_SMD]
Y1  25Mhz -14mm  [XTAL_314_240X47_SMD]

### Ports
COL (out), CRS (bidir), INT (out), MDC (out), MDIO (bidir), PHY_RESET (bidir), RX_CLK (bidir), RX_D0 (in), RX_D1 (in), RX_D2 (in), RX_D3 (in), RX_DV (bidir), RX_ERR (out), TX_CLK (bidir), TX_D1 (out), TX_D2 (out), TX_D3 (out), TX_DO (in), TX_EN (in)

### Nets
+3v3: C17.2 C18.2 C19.2 C20.2 FB1.2 R4.2 R7.2 R8.2 R9.2 U2.17(VDDIO)
EARTH: C23.1 R11.1
GND: C12.1 C13.1 C14.1 C15.1 C16.1 C17.1 C18.1 C19.1 C20.1 C21.1 C22.1 D1.A D2.A D3.A D4.A R5.2 R6.2 R10.1 SW2.1 U2.33(GND_PAD)
COL: DS2.A(ANODE) U2.28(COL/LED2/GPIO/Strap4) ; port COL
CRS: DS1.A(ANODE) U2.29(CRS/LED3/Strap3) ; port CRS
PHY_RESET: R4.1 SW2.2 U2.32(RST_N) ; port PHY_RESET
RD_N: D4.K J3.6(D3-) U2.4(RD_M)
RD_P: D3.K J3.5(D3+) U2.5(RD_P)
TD_N: D2.K J3.2(D1-) U2.6(TD_M)
TD_P: D1.K J3.1(D1+) U2.7(TD_P)
NetC12_2: C12.2 U2.2(CEXT)
NetC13_2: C13.2 C14.2 C15.2 C16.2 FB1.1 U2.3(VDDA3V3)
NetC21_2: C21.2 U2.8(XO) Y1.2
NetC22_2: C22.2 U2.9(XI/50MHzIn) Y1.1
NetC23_2: C23.2 J3.9(EARTH) J3.10(EARTH) R11.2
NetDS1_K: DS1.K(CATHODE) R5.1
NetDS2_K: DS2.K(CATHODE) R6.1
NetR7_1: R7.1 U2.1(ModeSelect)
NetR8_1: R8.1 U2.21(PWRDN/INT) ; port INT
NetR9_1: R9.1 U2.11(MDIO) ; port MDIO
NetR10_2: R10.2 U2.10(RBIAS)
NetU2_12: U2.12(MDC) ; port MDC
NetU2_13: U2.13(Strap7/RX_D3) ; port RX_D3
NetU2_14: U2.14(Strap8/RX_D2) ; port RX_D2
NetU2_15: U2.15(Strap9/RX_D1) ; port RX_D1
NetU2_16: U2.16(Strap0/RX_D0) ; port RX_D0
NetU2_18: U2.18(RX_DV/CRS_DV/Strap10) ; port RX_DV
NetU2_19: U2.19(RX_CLK/50MHz_RMI) ; port RX_CLK
NetU2_20: U2.20(RX_ER/Strap6) ; port RX_ERR
NetU2_22: U2.22(TX_CLK/Strap5) ; port TX_CLK
NetU2_23: U2.23(TX_EN) ; port TX_EN
NetU2_24: U2.24(TX_D0) ; port TX_DO
NetU2_25: U2.25(TX_D1) ; port TX_D1
NetU2_26: U2.26(TX_D2) ; port TX_D2
NetU2_27: U2.27(TX_D3) ; port TX_D3

Not connected (* = marked no-connect by the designer): J3 3(D2+)* 4(D2-)* 7(D4+)* 8(D4-)*; U2 30(LED0/Strap2) 31(CLKOUT/LED1/Strap1)

### Layout directives
differential pair; differential pair class DIFF100: RD_N, RD_P, TD_N, TD_P
net class 50OHM: (no net found under the mark)
net class Critical nets: PHY_RESET

### Notes on the sheet
- Title
- Size:
- Date:
- A3
- Number:
- Time:
- Revision:
- Sheet
- of
- File:

### Library data of the parts
C12 = CAP_2nF-50V-10%-0805: 2000pF ±10% 50V Ceramic Capacitor X7R 0805 (2012 Metric) /; Manufacturer: Samsung Electro-Mechanics; Manufacturer Part Number: CL21B202KBANNNC; Alternate Part Number-1: NA; Case/Package: 0805; Supplier-1: Digikey; Supplier Part Number-1: 1276-2471-1-ND - Cut Tape (CT)
C13 C20 = CAP_10uF-50V-10%-1206: 10µF ±10% 50V Ceramic Capacitor X7R 1206 (3216 Metric) /; Manufacturer: KEMET; Manufacturer Part Number: CL31B106KBHNNNE; Alternate Part Number-1: GRT31CR61H106ME01L; Case/Package: 1206; Supplier-1: SIRICOM; Supplier Part Number-1: CC1206KKX5R9BB106
C14 C19 = CAP_1uF-50V-5%-0805: as C1 on sheet [3]STM32F103_Debugger; Case/Package: 0805; Supplier-1: SIRICOM; Supplier Part Number-1: CL21B105KBFNNNE
C15 C18 = CAP_0.1uF-50V-5%-0805: as C2 on sheet [3]STM32F103_Debugger; Case/Package: 0805; Supplier-1: SIRICOM; Supplier Part Number-1: 0805B104J500CT
C16 C17 = CAP_10nF-50V-10%-0805: 10000pF ±10% 50V Ceramic Capacitor X7R 0805 (2012 Metric) /; Manufacturer: Samsung; Manufacturer Part Number: C0805C103K5RECAUTO; Alternate Part Number-1: GRM2195C1H103JA01D; Case/Package: 0805; Supplier-1: SIRICOM; Supplier Part Number-1: 0805B103K500CT
C21 C22 = CAP_20pF-50V-10%-0805: ±10% 50V Ceramic Capacitor C0G, NP0 0805 (2012 Metric) /; Manufacturer: AVX Corporation; Manufacturer Part Number: 08055A200KAT2A; Alternate Part Number-1: NA; Case/Package: 0805; Supplier-1: Digikey; Supplier Part Number-1: 478-11887-1-ND - Cut Tape (CT)
C23 = CAP_10nF-1KV-10%-RAD-TH: 10000pF ±10% 1000V (1kV) Ceramic Capacitor X7R Radial /; Manufacturer: Yageo; Manufacturer Part Number: RDER73A103K2K1H03B; Alternate Part Number-1: NA; Case/Package: TH; Supplier-1: SP ROAD; Supplier Part Number-1: RDER73A103K2K1H03B
D1-D4 = DIO-T_3.3V-8.8V-10A-SOD923: TVS DIODE 3.3V 8.8V SOD923; Manufacturer: Micro Commercial Co; Alternate Part Number-1: NA; Manufacturer Part Number: ESD3V3D9-TP; Case/Package: SOD923; Supplier-1: Digikey; Supplier Part Number-1: ESD3V3D9-TPMSTR-ND
DS1 DS2 = LED_RED-2V-20mA-0805: Red 631nm LED Indication - Discrete 2V 0805 (2012 Metric); Manufacturer: Vishay Lite-On; Manufacturer Part Number: LTST-C171KRKT; Alternate Part Number-1: NA; Case/Package: 0805; Supplier-1: SP ROAD; Supplier Part Number-1: LTST-C171KRKT
FB1 = FB_1K-100MHZ-1.6A-0805: 1 kOhms @ 100MHz 1 Power Line Ferrite Bead 0805 (2012 Metric) 1.6A; Manufacturer: Laird; Manufacturer Part Number: BLM21SP102SH1D; Alternate Part Number-1: NA; Case/Package: 0805; Supplier-1: SIRICOM; Supplier Part Number-1: ACMS201209A102
J3 = CON-SKT-RJ_8C8P-RA-TH: 8 Pins, 2 Row 2.54mm Pitch, right angle Connector, male; Manufacturer: Assmann; Manufacturer Part Number: A-2004-2-4-LPS-N-R; Alternate Part Number-1: NA; Case/Package: TH-CON; Supplier-1: SP ROAD; Supplier Part Number-1: A-2004-2-4-LPS-N-R
R4 R7-R9 = RES_10K-0.125W-1%-0805: as R3 on sheet [3]STM32F103_Debugger; Case/Package: 0805; Supplier-1: SIRICOM; Supplier Part Number-1: WR08X1002FTL; Alternate Part Number-1: WR08X1002FTL
R5 R6 = RES_330R-0.125W-1%-0805: 330 Ohms ±1% 0.125W, 1/8W Chip Resistor 0805 (2012 Metric) Automotive AEC-Q200 Thick Film /; Manufacturer: Walsin; Manufacturer Part Number: WR08X3300FTL; Alternate Part Number-1: NA; Case/Package: 0805; Supplier-1: SIRICOM; Supplier Part Number-1: WR08X3300FTL
R10 = RES_6.49K-0.125W-1%-0805: 6.49 kOhms ±1% 0.125W, 1/8W Chip Resistor 0805 (2012 Metric) Moisture Resistant Thick Film /; Manufacturer: Stackpole Electronics; Manufacturer Part Number: RC0805FR-076K49L; Alternate Part Number-1: NA; Case/Package: 0805; Supplier-1: SIRICOM; Supplier Part Number-1: WRO8X6491FTL
R11 = RES_1M-0.125W-1%-0805: 1 MOhms ±1% 0.125W, 1/8W Chip Resistor 0805 (2012 Metric) Automotive AEC-Q200 Thick Film /; Manufacturer: Walsin; Manufacturer Part Number: WR08X1004FTL; Alternate Part Number-1: 0805W8F1004T5E; Case/Package: 0805; Supplier-1: SIRICOM; Supplier Part Number-1: WR08X1004FTL
SW2 = SW1_RS-282G05A3-SMRT-SMD: as SW1 on sheet [3]STM32F103_Debugger; Manufacturer Part Number: RS-282G05A3-SMRT; Case/Package: SMD; Supplier-1: SP ROAD; Supplier Part Number-1: RS-282G05A3-SMRT
U2 = IC_DP83826IRHBR: Ethernet ICs Low latency 10/100-Mbps PHY, MII interface and enhanced mode with an industrial temperature range 32-VQFN -40 to 85; Manufacturer: Texas Instruments; Alternate Part Number-1: NA; Manufacturer Part Number: DP83826IRHBR; Case/Package: 32-VQFN; Supplier-1: Mouser; Supplier Part Number-1: 595-DP83826IRHBR
Y1 = XTAL_25Mhz-FOXSDLF/250F-20: 25MHz ±30ppm Crystal 20pF 30 Ohms HC-49/US /; Manufacturer: Abracon; Alternate Part Number-1: NA; Manufacturer Part Number: FOXSDLF/250F-20; Case/Package: SMD; Supplier-1: MOUSER; Supplier Part Number-1: FOXSDLF/250F-20

## Sheet [5]Motor_Driver.SchDoc
size A3; DocumentNumber: 5; SheetNumber: 5; SheetTotal: 11
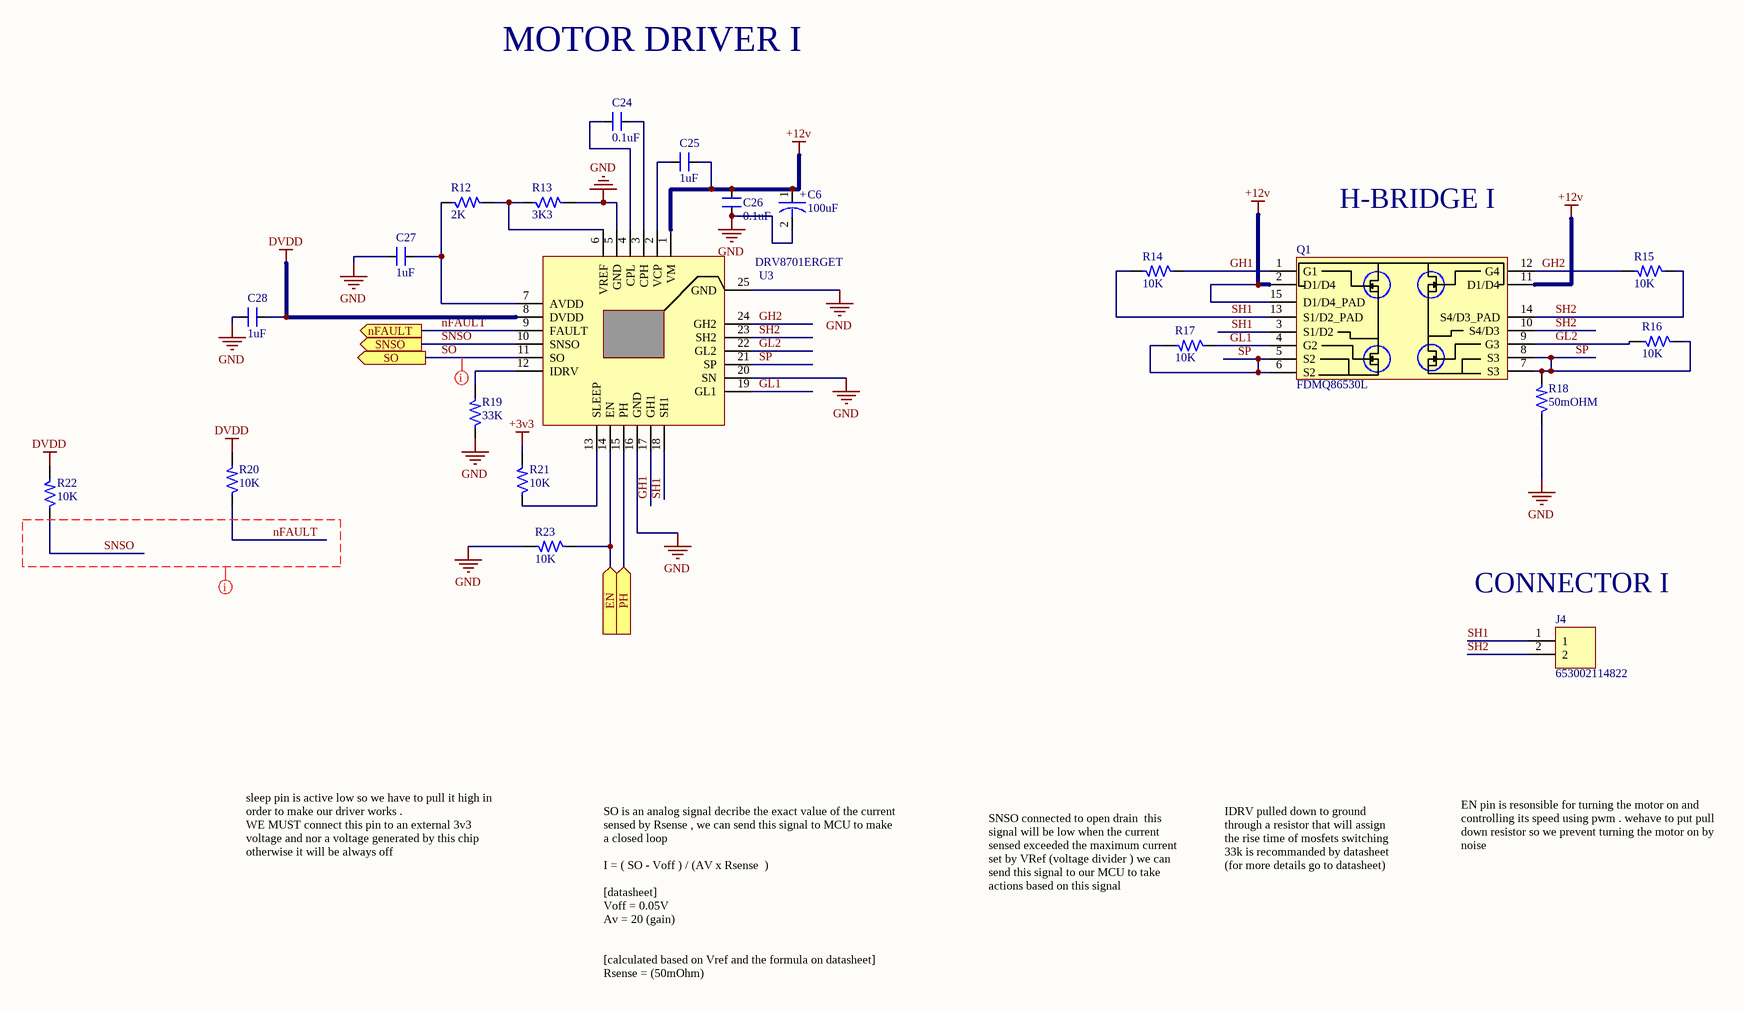
[diagram p14: [5]Motor_Driver.SchDoc]

### Parts
C6  100uF  [ACAP_P305_D393_H393_RAD]
C24  0.1uF  [CAP_0805]
C25  1uF  [CAP_0805]
C26  0.1uF  [CAP_0805]
C27  1uF  [CAP_0805]
C28  1uF  [CAP_0805]
J4  653002114822  [CON2_50_653002114822_TH_ST]
Q1  FDMQ86530L  [DFN5045-12_33_212_27X15_SMD_1]
R12  2K  [RES_0805]
R13  3K3  [RES_0603]
R14  10K  [RES_0805]
R15  10K  [RES_0805]
R16  10K  [RES_0805]
R17  10K  [RES_0805]
R18  50mOHM  [RES_2512]
R19  33K  [RES_0805]
R20  10K  [RES_0805]
R21  10K  [RES_0805]
R22  10K  [RES_0805]
R23  10K  [RES_0805]
U3  DRV8701ERGET  [VFQFN24_19.6_196_12X32_SMD_1]

### Ports
EN (in), nFAULT (out), PH (in), SNSO (out), SO (out)

### Nets
+3v3: R21.2
+12v: C6.1 C25.2 C26.2 Q1.2(D1/D4) Q1.11(D1/D4) Q1.15(D1/D4_PAD) U3.1(VM)
DVDD: C28.2 R20.2 R22.2 U3.8(DVDD)
GND: C6.2 C26.1 C27.1 C28.1 R13.2 R18.1 R19.1 R23.2 U3.5(GND) U3.16(GND) U3.20(SN) U3.25(GND)
GH1: Q1.1(G1) R14.1 U3.17(GH1)
GH2: Q1.12(G4) R15.2 U3.24(GH2)
GL1: Q1.4(G2) R17.1 U3.19(GL1)
GL2: Q1.9(G3) R16.2 U3.22(GL2)
nFAULT: R20.1 U3.9(FAULT) ; port nFAULT
SH1: J4.1 Q1.3(S1/D2) Q1.13(S1/D2_PAD) R14.2 U3.18(SH1)
SH2: J4.2 Q1.10(S4/D3) Q1.14(S4/D3_PAD) R15.1 U3.23(SH2)
SNSO: R22.1 U3.10(SNSO) ; port SNSO
SO: U3.11(SO) ; port SO
SP: Q1.5(S2) Q1.6(S2) Q1.7(S3) Q1.8(S3) R16.1 R17.2 R18.2 U3.21(SP)
NetC24_1: C24.1 U3.4(CPL)
NetC24_2: C24.2 U3.3(CPH)
NetC25_1: C25.1 U3.2(VCP)
NetC27_2: C27.2 R12.1 U3.7(AVDD)
NetR12_2: R12.2 R13.1 U3.6(VREF)
NetR19_2: R19.2 U3.12(IDRV)
NetR21_1: R21.1 U3.13(SLEEP)
NetR23_1: R23.1 U3.14(EN) ; port EN
NetU3_15: U3.15(PH) ; port PH

### Layout directives
net class Critical nets: nFAULT, SNSO, SO

### Notes on the sheet
- MOTOR DRIVER I
- H-BRIDGE I
- (near J4) CONNECTOR I
- sleep pin is active low so we have to pull it high in order to make our driver works .
  WE MUST connect this pin to an external 3v3 voltage and nor a voltage generated by this chip otherwise it will be always off
- SNSO connected to open drain  this signal will be low when the current sensed exceeded the maximum current set by VRef (voltage divider ) we can send this signal to our MCU to take actions based on this signal
- IDRV pulled down to ground through a resistor that will assign the rise time of mosfets switching
  33k is recommanded by datasheet
  (for more details go to datasheet)
- EN pin is resonsible for turning the motor on and controlling its speed using pwm . wehave to put pull down resistor so we prevent turning the motor on by noise
- SO is an analog signal decribe the exact value of the current  sensed by Rsense , we can send this signal to MCU to make a closed loop
  I = ( SO - Voff ) / (AV x Rsense  )
  [datasheet]
  Voff = 0.05V
  Av = 20 (gain)
  [calculated based on Vref and the formula on datasheet]
  Rsense = (50mOhm)
- Title
- Size:
- Date:
- A3
- Number:
- Time:
- Revision:
- Sheet
- of
- File:
- (in symbol CAP-P_100uF-50V-20%-RAD) +

### Library data of the parts
C6 = CAP-P_100uF-50V-20%-RAD: 100µF 50V Aluminum Polymer Capacitor Radial, Can - SMD 28mOhm 4000 Hrs @ 125°C /; Manufacturer: Nichicon; Manufacturer Part Number: GYA1H101MCQ1GS; Alternate Part Number-1: VEU101M1HTR-1010; Case/Package: Radial-SMD; Supplier-1: SP ROAD; Supplier Part Number-1: GYA1H101MCQ1GS
C24 C26 = CAP_0.1uF-50V-5%-0805: as C2 on sheet [3]STM32F103_Debugger; Case/Package: 0805; Supplier-1: SIRICOM; Supplier Part Number-1: 0805B104J500CT
C25 C27 C28 = CAP_1uF-50V-5%-0805: as C1 on sheet [3]STM32F103_Debugger; Case/Package: 0805; Supplier-1: SIRICOM; Supplier Part Number-1: CL21B105KBFNNNE
J4 = CON-PLG_2X1-50-ST-TH: 2 Pins, 1 Row 1.25mm Pitch, Straight Connector, male; Manufacturer: JST; Mating Part Number: 653002113322; Crimp Part Number: 653153128130; Alternate Part Number-1: NA; Manufacturer Part Number: 653002114822; Case/Package: TH-CON; Supplier-1: WURTH; Supplier Part Number-1: 653002114822
Q1 = MOSFET-N_60V-8A-V-DFN5045-12: Mosfet Array 4 N-Channel 8A (Ta) Surface Mount V-DFN5045-12; Manufacturer: ON Semiconductor; Alternate Part Number-1: NA; Manufacturer Part Number: FDMQ86530L; Case/Package: DFN5045-12; Supplier-1: Arrow; Supplier Part Number-1: FDMQ86530L
R12 = RES_2K-0.125W-1%-0805: 2 kOhms ±1% 0.125W, 1/8W Chip Resistor 0805 (2012 Metric) Moisture Resistant Thick Film /; Manufacturer: TE Connectivity; Manufacturer Part Number: RC0805FR-072KL; Alternate Part Number-1: NA; Case/Package: 0805; Supplier-1: SIRICOM; Supplier Part Number-1: WR08X2001FTL
R13 = RES_3.3K-0.1W-1%-0603: 3.3 kOhms ±1% 0.1W, 1/10W Chip Resistor 0603 (1608 Metric) Automotive AEC-Q200 Thick Film /; Manufacturer: Wilson; Manufacturer Part Number: WR06X3301FTL; Alternate Part Number-1: 0603WAF3301T5E; Case/Package: 0603; Supplier-1: SIRICOM; Supplier Part Number-1: WR06X3301FTL
R14-R17 R20-R23 = RES_10K-0.125W-1%-0805: as R3 on sheet [3]STM32F103_Debugger; Case/Package: 0805; Supplier-1: SIRICOM; Supplier Part Number-1: WR08X1002FTL; Alternate Part Number-1: WR08X1002FTL
R18 = RES_50mOhm-2W-1%-2512: 50 mOhms ±1% 2W Chip Resistor 2512 (6432 Metric) Automotive AEC-Q200, Current Sense, Moisture Resistant Metal Element /; Manufacturer: Yageo; Manufacturer Part Number: PA2512FKF7W0R05E; Alternate Part Number-1: PMR100HZPFU5L00; Case/Package: 2512; Supplier-1: SIRICOM; Supplier Part Number-1: LR2512-22R060F1
R19 = RES_33K-0.125W-1%-0805: Thick Film Resistors - SMD 33KOhms 1/8W 150V33 kOhms ±1% 0.125W, 1/8W Chip Resistor 0805 (2012 Metric) Thick Film /; Manufacturer: Vishay BCcomponents; Manufacturer Part Number: CRG0805F33K; Alternate Part Number-1: NA; Case/Package: 0805; Supplier-1: SIRICOM; Supplier Part Number-1: WR08X3302FTL
U3 = IC_DRV8701ERGET: Motor Driver Power MOSFET Parallel 24-VQFN (4x4); Manufacturer: Texas Instruments; Alternate Part Number-1: NA; Manufacturer Part Number: DRV8701ERGET; Case/Package: VFQFN24; Supplier-1: ARROW; Supplier Part Number-1: DRV8701ERGET

## Sheet [6]CH340C.SchDoc
size A3; DocumentNumber: 6; SheetNumber: 6; SheetTotal: 11
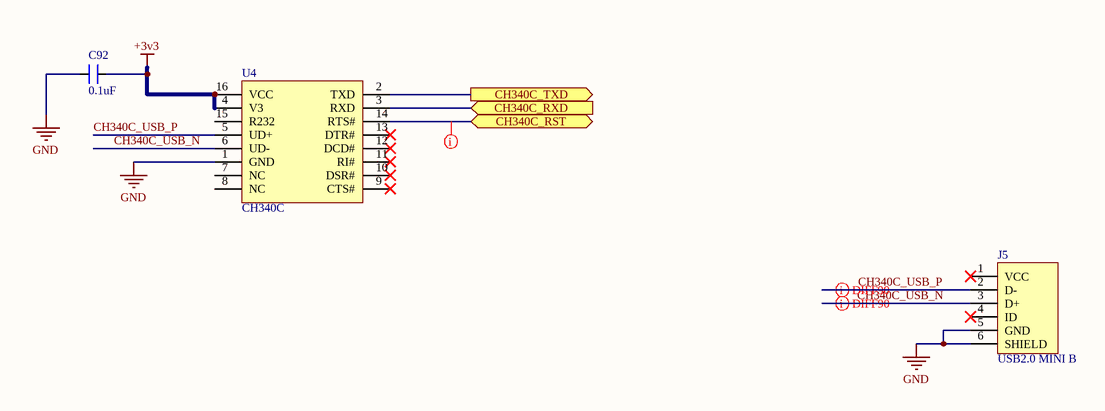
[diagram p15: [6]CH340C.SchDoc]

### Parts
C92  0.1uF  [CAP_0805]
J5  USB2.0 MINI B  [CON_690-005-299-043]
U4  CH340C  [SOIC16_50_284_25X90_SMT]

### Ports
CH340C_RST (bidir), CH340C_RXD (in), CH340C_TXD (out)

### Nets
+3v3: C92.2 U4.4(V3) U4.16(VCC)
GND: C92.1 J5.5(GND) J5.6(SHIELD) U4.1(GND)
CH340C_USB_N: J5.3(D+) U4.6(UD-)
CH340C_USB_P: J5.2(D-) U4.5(UD+)
NetU4_2: U4.2(TXD) ; port CH340C_TXD
NetU4_3: U4.3(RXD) ; port CH340C_RXD
NetU4_14: U4.14(RTS#) ; port CH340C_RST

Not connected (* = marked no-connect by the designer): J5 1(VCC)* 4(ID)*; U4 7(NC) 8(NC) 9(CTS#)* 10(DSR#)* 11(RI#)* 12(DCD#)* 13(DTR#)* 15(R232)

### Layout directives
differential pair; differential pair class DIFF90: CH340C_USB_N, CH340C_USB_P
net class Critical nets: NetU4_14

### Notes on the sheet
- Title
- Size:
- Date:
- A3
- Number:
- Time:
- Revision:
- Sheet
- of
- File:

### Library data of the parts
C92 = CAP_0.1uF-50V-5%-0805: as C2 on sheet [3]STM32F103_Debugger; Case/Package: 0805; Supplier-1: SIRICOM; Supplier Part Number-1: 0805B104J500CT
J5 = CON_USB2.0-MINIB-SMD: as J2 on sheet [3]STM32F103_Debugger; Case/Package: USB-MINI-B; Supplier-1: LCSC; Supplier Part Number-1: C105424
U4 = IC_CH340C: USB Bridge, USB to UART USB 2.0 UART Interface; Manufacturer: Olimex; Alternate Part Number-1: NA; Manufacturer Part Number: CH340C; Case/Package: SOIC16; Supplier-1: LCSC; Supplier Part Number-1: C84681

## Sheet [7]DAC_and_MIC.SchDoc
size A3; DocumentNumber: 7; SheetNumber: 7; SheetTotal: 11
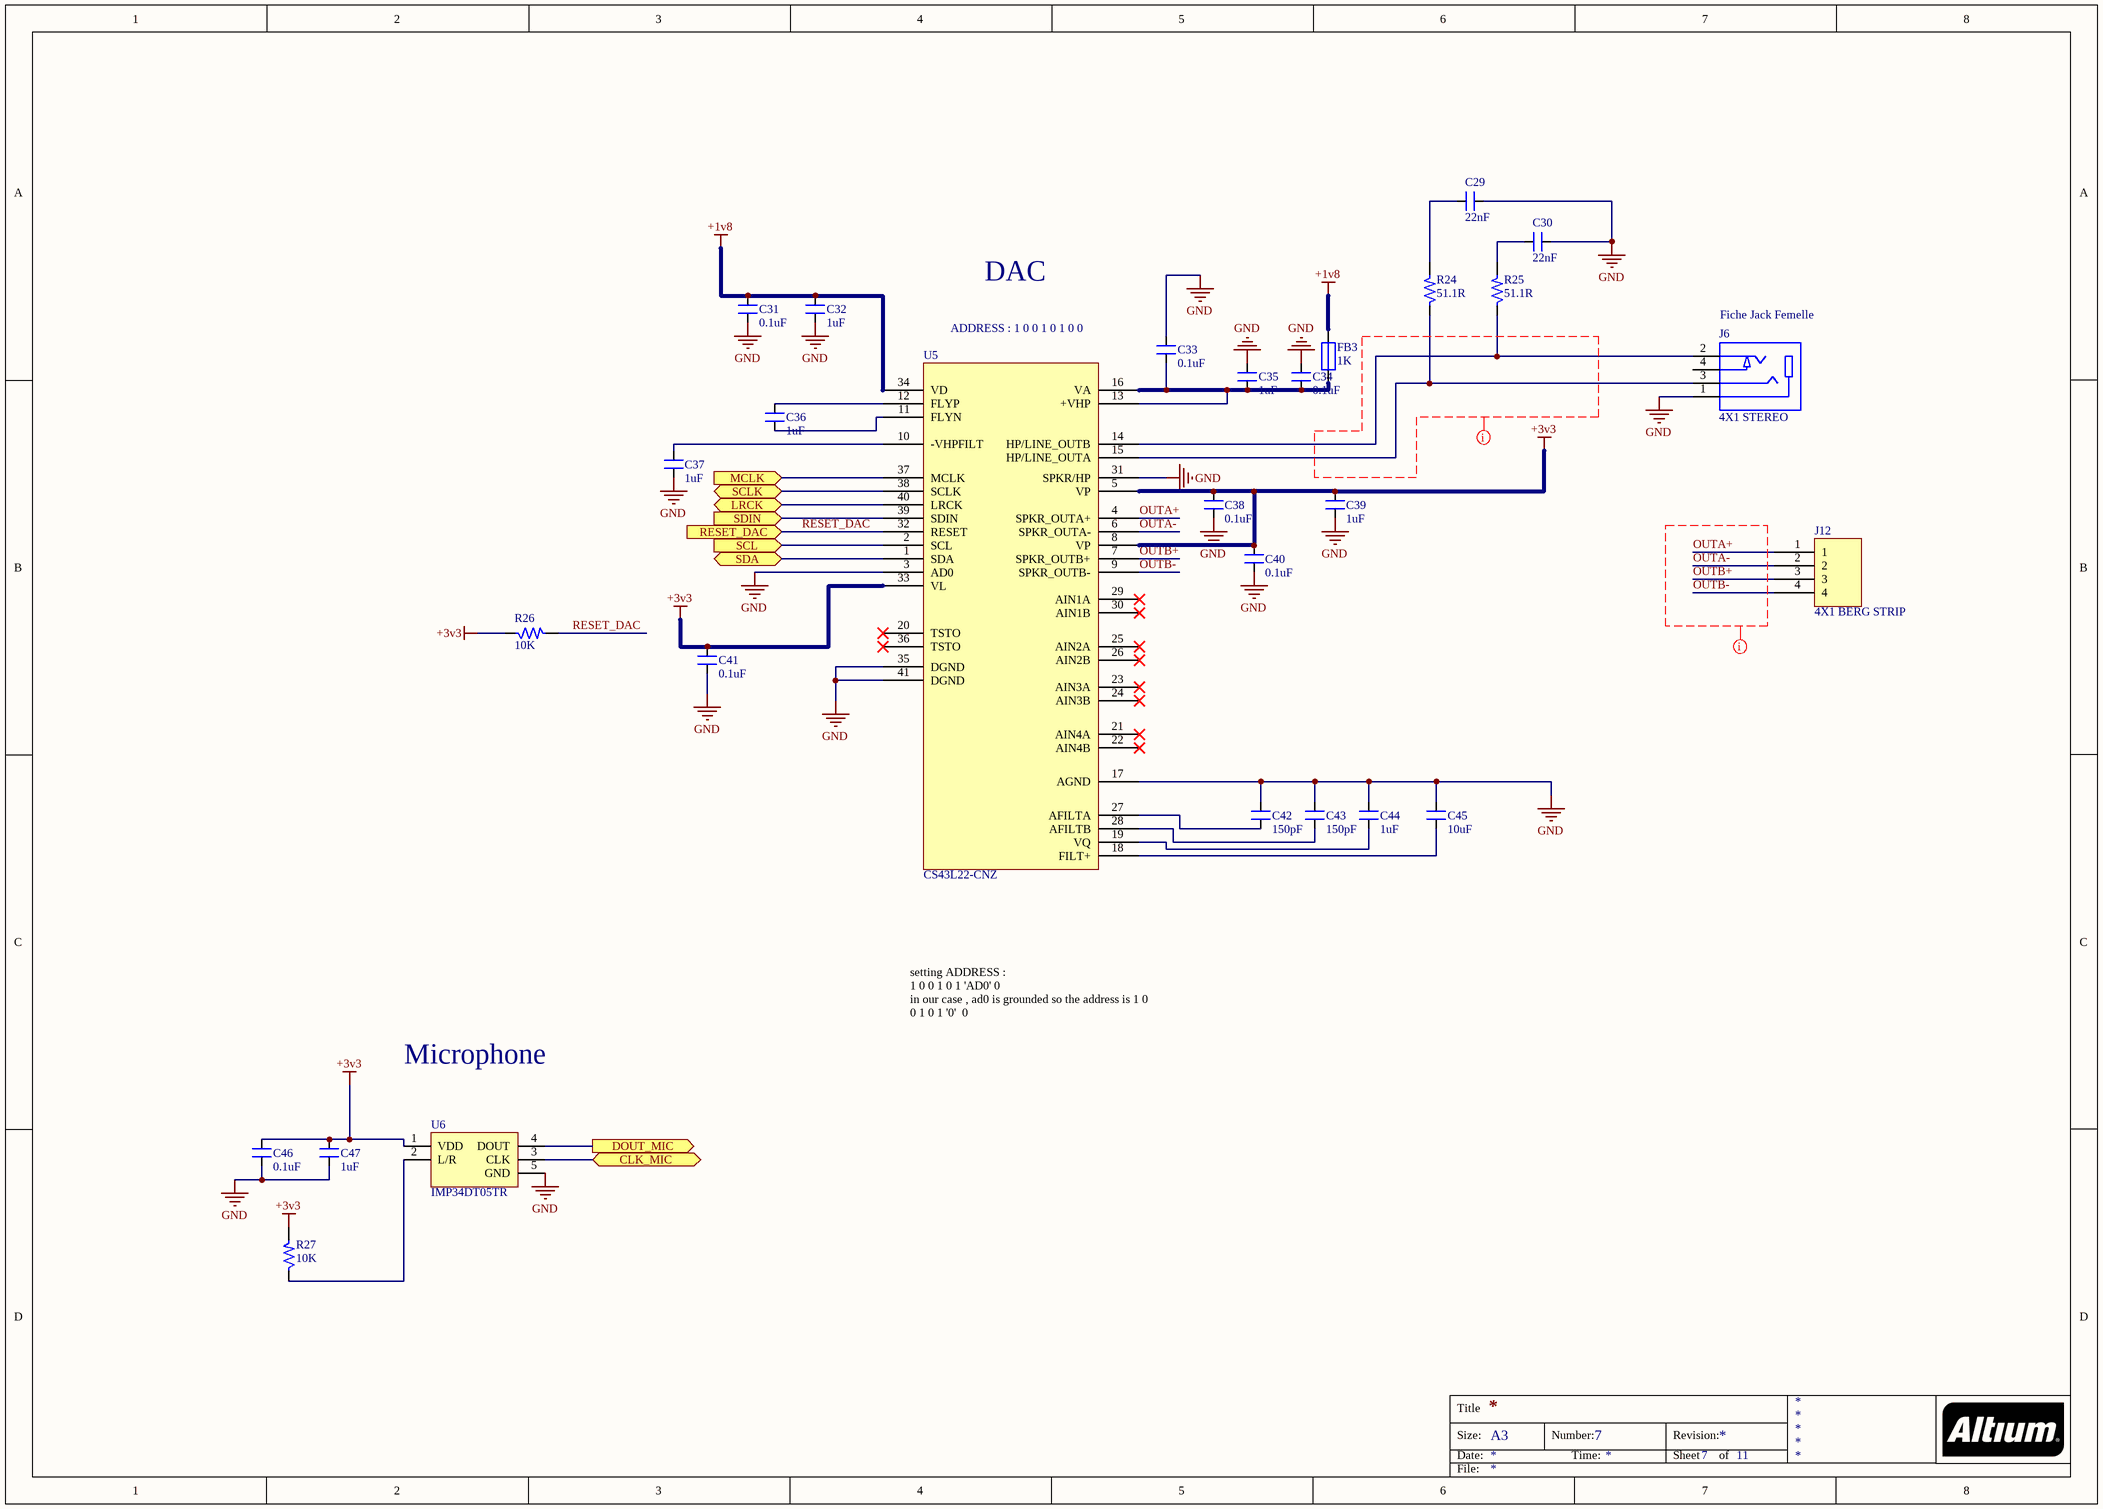
[diagram p16: [7]DAC_and_MIC.SchDoc]

### Parts
C29  22nF  [CAP_0805]
C30  22nF  [CAP_0805]
C31  0.1uF  [CAP_0805]
C32  1uF  [CAP_0805]
C33  0.1uF  [CAP_0805]
C34  0.1uF  [CAP_0805]
C35  1uF  [CAP_0805]
C36  1uF  [CAP_0805]
C37  1uF  [CAP_0805]
C38  0.1uF  [CAP_0805]
C39  1uF  [CAP_0805]
C40  0.1uF  [CAP_0805]
C41  0.1uF  [CAP_0805]
C42  150pF  [CAP_0805]
C43  150pF  [CAP_0805]
C44  1uF  [CAP_0805]
C45  10uF  [CAP_1206]
C46  0.1uF  [CAP_0805]
C47  1uF  [CAP_0805]
FB3  1K  [IND_0805]
J6  4X1 STEREO  [CON_SJ-2504A-SMT-TR_SMD]
J12  4X1 BERG STRIP  [CON4_100_40D72_TH_ST_MALE]
R24  51.1R  [RES_0603]
R25  51.1R  [RES_0603]
R26  10K  [RES_0603]
R27  10K  [RES_0603]
U5  CS43L22-CNZ  [QFN40_19_284_33X9_SMD]
U6  IMP34DT05TR  [HCLGA-4_53_137_15X37_SMD]

### Ports
CLK_MIC (bidir), DOUT_MIC (out), LRCK (bidir), MCLK (in), RESET_DAC (in), SCL (in), SCLK (bidir), SDA (bidir), SDIN (in)

### Nets
+1v8: C31.2 C32.2 FB3.2 U5.34(VD)
+3v3: C38.2 C39.2 C40.2 C41.2 C46.2 C47.2 R26.1 R27.2 U5.5(VP) U5.8(VP) U5.33(VL) U6.1(VDD)
GND: C29.2 C30.2 C31.1 C32.1 C33.2 C34.1 C35.1 C37.1 C38.1 C39.1 C40.1 C41.1 C42.2 C43.2 C44.2 C45.2 C46.1 C47.1 J6.1 U5.3(AD0) U5.17(AGND) U5.31(SPKR/HP) U5.35(DGND) U5.41(DGND) U6.5(GND)
OUTA+: J12.1 U5.4(SPKR_OUTA+)
OUTA-: J12.2 U5.6(SPKR_OUTA-)
OUTB+: J12.3 U5.7(SPKR_OUTB+)
OUTB-: J12.4 U5.9(SPKR_OUTB-)
RESET_DAC: R26.2 U5.32(RESET) ; port RESET_DAC
NetC29_1: C29.1 R24.2
NetC30_1: C30.1 R25.2
NetC33_1: C33.1 C34.2 C35.2 FB3.1 U5.13(+VHP) U5.16(VA)
NetC36_1: C36.1 U5.11(FLYN)
NetC36_2: C36.2 U5.12(FLYP)
NetC37_2: C37.2 U5.10(-VHPFILT)
NetC42_1: C42.1 U5.27(AFILTA)
NetC43_1: C43.1 U5.28(AFILTB)
NetC44_1: C44.1 U5.19(VQ)
NetC45_1: C45.1 U5.18(FILT+)
NetJ6_2: J6.2 R25.1 U5.14(HP/LINE_OUTB)
NetJ6_3: J6.3 R24.1 U5.15(HP/LINE_OUTA)
NetR27_1: R27.1 U6.2(L/R)
NetR28_1: U5.1(SDA) ; port SDA
NetR29_1: U5.2(SCL) ; port SCL
NetU5_37: U5.37(MCLK) ; port MCLK
NetU5_38: U5.38(SCLK) ; port SCLK
NetU5_39: U5.39(SDIN) ; port SDIN
NetU5_40: U5.40(LRCK) ; port LRCK
NetU6_3: U6.3(CLK) ; port CLK_MIC
NetU6_4: U6.4(DOUT) ; port DOUT_MIC

Not connected (* = marked no-connect by the designer): J6 4; U5 20(TSTO)* 21(AIN4A)* 22(AIN4B)* 23(AIN3A)* 24(AIN3B)* 25(AIN2A)* 26(AIN2B)* 29(AIN1A)* 30(AIN1B)* 36(TSTO)*

### Layout directives
net class Critical nets: +3v3, OUTA+, OUTA-, OUTB+, OUTB-

### Notes on the sheet
- DAC
- (near J6) Fiche Jack Femelle
- ADDRESS : 1 0 0 1 0 1 0 0
- Microphone
- setting ADDRESS :
  1 0 0 1 0 1 'AD0' 0
  in our case , ad0 is grounded so the address is 1 0 0 1 0 1 '0'  0
- Title
- Size:
- Date:
- A3
- Number:
- Time:
- Revision:
- Sheet
- of
- File:

### Library data of the parts
C29 C30 = CAP_22nF-50V-10%-0805: 0.022µF ±10% 50V Ceramic Capacitor X7R 0805 (2012 Metric) /; Manufacturer: Samsung Electro-Mechanics; Manufacturer Part Number: CL21B223KBANNNC; Alternate Part Number-1: NA; Case/Package: 0805; Supplier-1: Digikey; Supplier Part Number-1: 1276-1081-1-ND - Cut Tape (CT)
C31 C33 C34 C38 C40 C41 C46 = CAP_0.1uF-50V-5%-0805: as C2 on sheet [3]STM32F103_Debugger; Case/Package: 0805; Supplier-1: SIRICOM; Supplier Part Number-1: 0805B104J500CT
C32 C35-C37 C39 C44 C47 = CAP_1uF-50V-5%-0805: as C1 on sheet [3]STM32F103_Debugger; Case/Package: 0805; Supplier-1: SIRICOM; Supplier Part Number-1: CL21B105KBFNNNE
C42 C43 = CAP_150pF-50V-10%-0805: 150pF ±10% 50V Ceramic Capacitor C0G, NP0 0805 (2012 Metric) /; Manufacturer: AVX Corporation; Manufacturer Part Number: 08055A151KAT2A; Alternate Part Number-1: NA; Case/Package: 0805; Supplier-1: Digikey; Supplier Part Number-1: 478-10501-1-ND - Cut Tape (CT)
C45 = CAP_10uF-50V-10%-1206: as C13 on sheet [4]Ethernet_PHY; Case/Package: 1206; Supplier-1: SIRICOM; Supplier Part Number-1: CC1206KKX5R9BB106
FB3 = FB_1K-100MHZ-1.6A-0805: as FB1 on sheet [4]Ethernet_PHY; Case/Package: 0805; Supplier-1: SIRICOM; Supplier Part Number-1: ACMS201209A102
J6 = CON-PLG-STEREO_4X1-100-RA-SMD: 2.50mm (0.094", 3/32", Sub Mini, Miniature) - Headphone Phone Jack Stereo (4 Conductor, TRRS) Connector Solder; Manufacturer: CUI Devices; Manufacturer Part Number: SJ-2504A-SMT-TR; Alternate Part Number-1: NA; Case/Package: SMD; Supplier Part Number-1: CP-SJ-2504A-SMT-CT-ND - Cut Tape (CT); Supplier-1: Digikey
J12 = CON-BS-PLG_4X1-100-ST-TH: 4 Pins, 1 Row 2.54mm Pitch, Straight bergstrip, Male; Manufacturer: NA; Manufacturer Part Number: NA; Case/Package: TH-CON; Supplier-1: SP ROAD; Supplier Part Number-1: NA; Alternate Part Number-1: NA
R24 R25 = RES_51.1R-0.1W-1%-0603: 51.1 Ohms ±1% 0.1W, 1/10W Chip Resistor 0603 (1608 Metric) Thick Film /; Manufacturer: Vishay Dale; Manufacturer Part Number: CRCW060351R1FKEAC; Alternate Part Number-1: NA; Case/Package: 0603; Supplier-1: Digikey; Supplier Part Number-1: 541-5468-1-ND - Cut Tape (CT)
R26 R27 = RES_10K-0.1W-1%-0603: 10 kOhms ±1% 0.1W, 1/10W Chip Resistor 0603 (1608 Metric) Automotive AEC-Q200 Thick Film /; Manufacturer: Walsin; Manufacturer Part Number: WR06X1002FTL; Alternate Part Number-1: 0603WAJ0103T5E; Case/Package: 0603; Supplier-1: SIRICOM; Supplier Part Number-1: WR06X1002FTL
U5 = IC_CS43L22: Audio D/A Converter ICs Low Power Stereo DAC w/ClassD Spkr Driver; Manufacturer: Cirrus Logic; Alternate Part Number-1: NA; Manufacturer Part Number: CS43L22-CNZ; Case/Package: QFN-40; Supplier-1: Mouser; Supplier Part Number-1: 777-CS43L22-CNZ
U6 = IC_IMP34DT05TR: MEMS Microphones AUTO & INDUSTRIAL SENSORS; Manufacturer: STMicroelectronics; Alternate Part Number-1: NA; Manufacturer Part Number: IMP34DT05TR; Case/Package: HCLGA-4; Supplier-1: Mouser; Supplier Part Number-1: 511-IMP34DT05TR

## Sheet [8]ADC_chip.SchDoc
size A3; DocumentNumber: 8; SheetNumber: 8; SheetTotal: 11
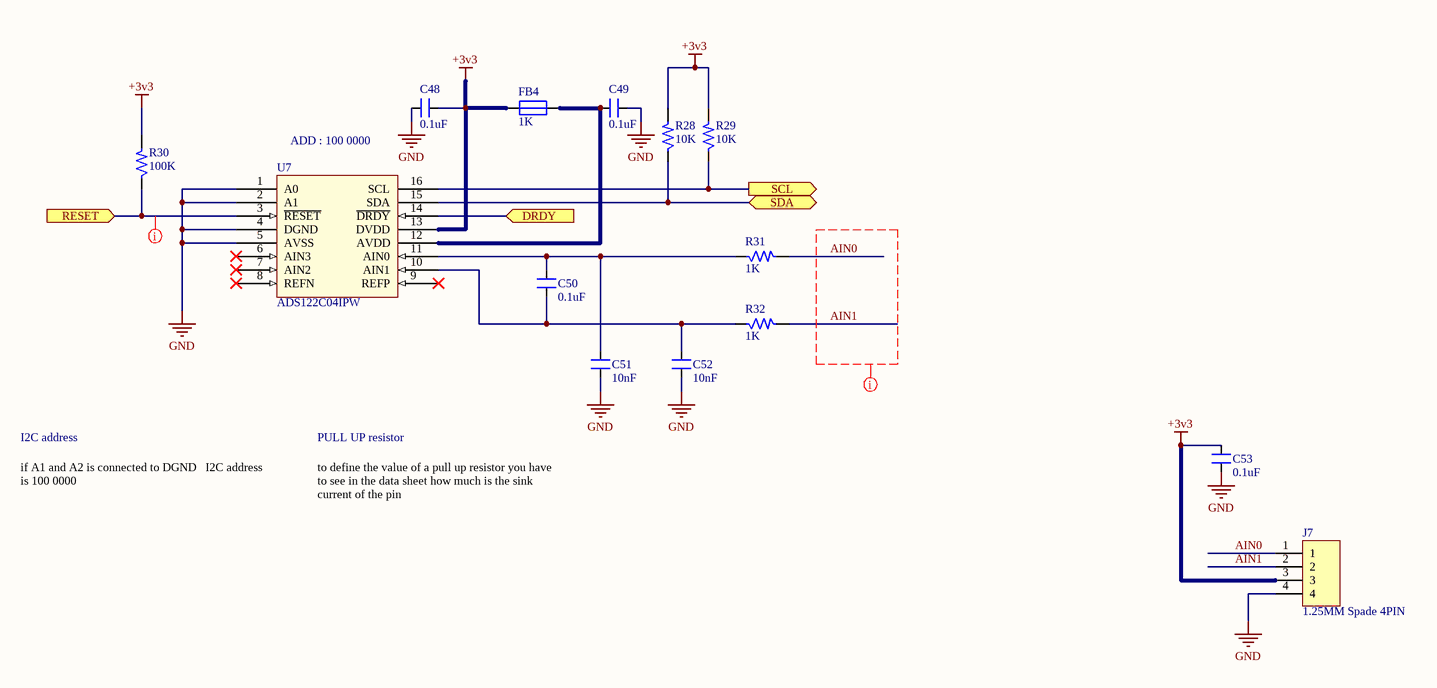
[diagram p17: [8]ADC_chip.SchDoc]

### Parts
C48  0.1uF  [CAP_0805]
C49  0.1uF  [CAP_0805]
C50  0.1uF  [CAP_0805]
C51  10nF  [CAP_0805]
C52  10nF  [CAP_0805]
C53  0.1uF  [CAP_0805]
FB4  1K  [IND_0805]
J7  1.25MM Spade 4PIN  [CON4_50_653004117322_TH_RA]
R28  10K  [RES_0603]
R29  10K  [RES_0603]
R30  100K  [RES_0603]
R31  1K  [RES_0603]
R32  1K  [RES_0603]
U7  ADS122C04IPW  [TSSOP16_25-59_294_54X14_SMT]

### Ports
DRDY (in), RESET (in), SCL (out), SDA (bidir)

### Nets
+3v3: C48.2 C53.2 FB4.1 J7.3 R28.2 R29.2 R30.2 U7.13(DVDD)
GND: C48.1 C49.2 C51.1 C52.1 C53.1 J7.4 U7.1(A0) U7.2(A1) U7.4(DGND) U7.5(AVSS)
AIN0: J7.1 R31.2
AIN1: J7.2 R32.2
NetC49_1: C49.1 FB4.2 U7.12(AVDD)
NetC50_1: C50.1 C52.2 R32.1 U7.10(AIN1)
NetC50_2: C50.2 C51.2 R31.1 U7.11(AIN0)
NetR28_1: R28.1 U7.15(SDA) ; port SDA
NetR29_1: R29.1 U7.16(SCL) ; port SCL
NetR30_1: R30.1 U7.3(~{RESET}) ; port RESET
NetU7_14: U7.14(~{DRDY}) ; port DRDY

Not connected (* = marked no-connect by the designer): U7 6(AIN3)* 7(AIN2)* 8(REFN)* 9(REFP)*

### Layout directives
net class Critical nets: AIN0, AIN1, NetR30_1

### Notes on the sheet
- ADD : 100 0000
- I2C address
- PULL UP resistor
- if A1 and A2 is connected to DGND   I2C address is 100 0000
- to define the value of a pull up resistor you have to see in the data sheet how much is the sink current of the pin
- Title
- Size:
- Date:
- A3
- Number:
- Time:
- Revision:
- Sheet
- of
- File:

### Library data of the parts
C48-C50 C53 = CAP_0.1uF-50V-5%-0805: as C2 on sheet [3]STM32F103_Debugger; Case/Package: 0805; Supplier-1: SIRICOM; Supplier Part Number-1: 0805B104J500CT
C51 C52 = CAP_10nF-50V-10%-0805: as C16 on sheet [4]Ethernet_PHY; Case/Package: 0805; Supplier-1: SIRICOM; Supplier Part Number-1: 0805B103K500CT
FB4 = FB_1K-100MHZ-1.6A-0805: as FB1 on sheet [4]Ethernet_PHY; Case/Package: 0805; Supplier-1: SIRICOM; Supplier Part Number-1: ACMS201209A102
J7 = CON-PLG_4X1-50-RA-TH: 4 Pins, 1 Row 1.25mm Pitch, right angle Connector, male; Manufacturer Part Number: 653004117322; Manufacturer: JST; Mating Part Number: 653004113322; Crimp Part Number: 653153128130; Alternate Part Number-1: NA; Case/Package: TH-CON; Supplier-1: WURTH; Supplier Part Number-1: 653004117322
R28 R29 = RES_10K-0.1W-1%-0603: as R26 on sheet [7]DAC_and_MIC; Case/Package: 0603; Supplier-1: SIRICOM; Supplier Part Number-1: WR06X1002FTL
R30 = RES_100K-0.1W-1%-0603: 100 kOhms ±1% 0.1W, 1/10W Chip Resistor 0603 (1608 Metric) Automotive AEC-Q200 Thick Film /; Manufacturer: Stackpole Electronics; Manufacturer Part Number: RMCF0603FT100K; Alternate Part Number-1: NA; Case/Package: 0603; Supplier-1: Arrow; Supplier Part Number-1: RMCF0603FT100K
R31 R32 = RES_1K-0.1W-1%-0603: 1 kOhms ±1% 0.1W, 1/10W Chip Resistor 0603 (1608 Metric) Automotive AEC-Q200 Thick Film /; Manufacturer: Walsin; Manufacturer Part Number: WR06X1001FTL; Alternate Part Number-1: 0603WAF1001T5E; Case/Package: 0603; Supplier-1: SIRICOM; Supplier Part Number-1: WR06X1001FTL
U7 = IC_ADS122C04IPW: 24 Bit Analog to Digital Converter 4 Input 1 Sigma-Delta 16-TSSOP; Manufacturer: Texas Instruments; Alternate Part Number-1: NA; Manufacturer Part Number: ADS122C04IPW; Case/Package: TSSOP16; Supplier-1: MOUSER; Supplier Part Number-1: ADS122C04IPW

## Sheet [9]STM32F407_Controller.SchDoc
size A3; DocumentNumber: 9; SheetNumber: 9; SheetTotal: 11
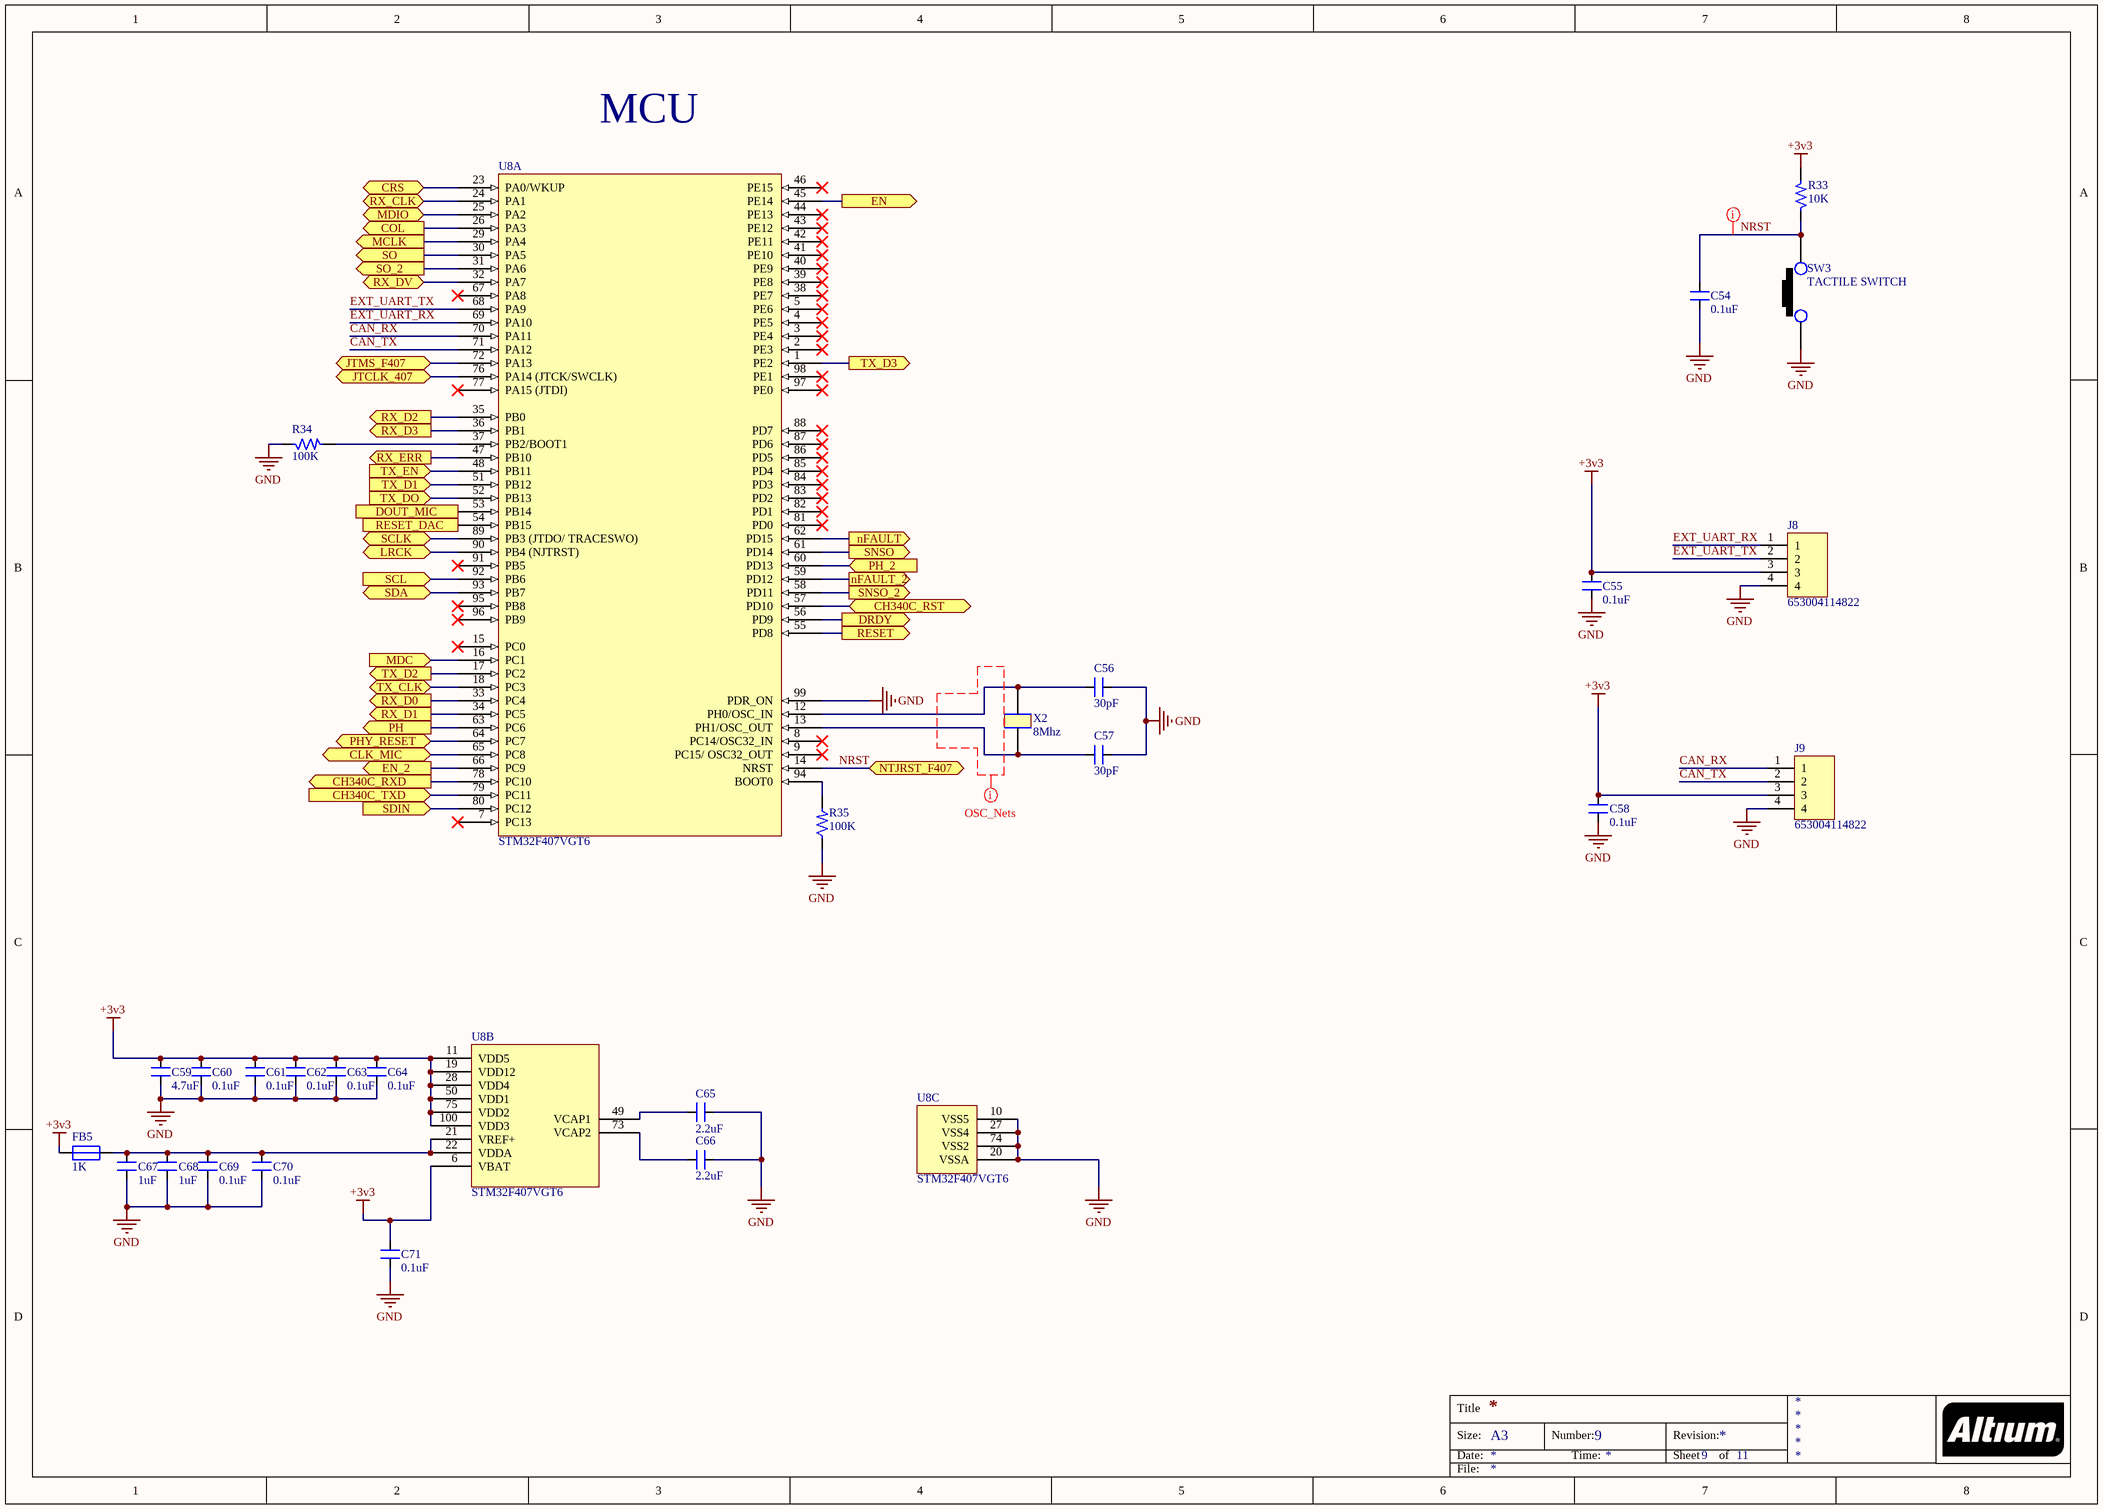
[diagram p18: [9]STM32F407_Controller.SchDoc]

### Parts
C54  0.1uF  [CAP_0805]
C55  0.1uF  [CAP_0805]
C56  30pF  [CAP_0805]
C57  30pF  [CAP_0805]
C58  0.1uF  [CAP_0805]
C59  4.7uF  [CAP_0805]
C60  0.1uF  [CAP_0805]
C61  0.1uF  [CAP_0805]
C62  0.1uF  [CAP_0805]
C63  0.1uF  [CAP_0805]
C64  0.1uF  [CAP_0805]
C65  2.2uF  [CAP_0805]
C66  2.2uF  [CAP_0805]
C67  1uF  [CAP_0805]
C68  1uF  [CAP_0805]
C69  0.1uF  [CAP_0805]
C70  0.1uF  [CAP_0805]
C71  0.1uF  [CAP_0805]
FB5  1K  [IND_0805]
J8  653004114822  [CON4_50_653004114822_TH_ST]
J9  653004114822  [CON4_50_653004114822_TH_ST]
R33  10K  [RES_0805]
R34  100K  [RES_0805]
R35  100K  [RES_0805]
SW3  TACTILE SWITCH  [SW_342_SMD]
U8  STM32F407VGT6  [QFN100_19.6_669_58X10_SMD]  (parts A,B,C of 3)
X2  8Mhz  [XTAL_314_240X47_SMD]

### Ports
CH340C_RST (bidir), CH340C_RXD (out), CH340C_TXD (in), CLK_MIC (bidir), COL (out), CRS (bidir), DOUT_MIC (in), DRDY (out), EN (out), EN_2 (out), JTCLK_407 (bidir), JTMS_F407 (bidir), LRCK (bidir), MCLK (out), MDC (in), MDIO (bidir), nFAULT (out), nFAULT_2 (out), NTJRST_F407 (bidir), PH (out), PH_2 (in), PHY_RESET (bidir), RESET (out), RESET_DAC (in), RX_CLK (bidir), RX_D0 (out), RX_D1 (out), RX_D2 (out), RX_D3 (out), RX_DV (bidir), RX_ERR (out), SCL (in), SCLK (bidir), SDA (bidir), SDIN (in), SNSO (out), SNSO_2 (out), SO (out), SO_2 (out), TX_CLK (bidir), TX_D1 (in), TX_D2 (out), TX_D3 (out), TX_DO (in), TX_EN (in)

### Nets
+3v3: C55.2 C58.2 C59.2 C60.2 C61.2 C62.2 C63.2 C64.2 C71.2 FB5.1 J8.3 J9.3 R33.2 U8.6(VBAT) U8.11(VDD5) U8.19(VDD12) U8.28(VDD4) U8.50(VDD1) U8.75(VDD2) U8.100(VDD3)
GND: C54.1 C55.1 C56.2 C57.2 C58.1 C59.1 C60.1 C61.1 C62.1 C63.1 C64.1 C65.2 C66.2 C67.1 C68.1 C69.1 C70.1 C71.1 J8.4 J9.4 R34.1 R35.1 SW3.1 U8.10(VSS5) U8.20(VSSA) U8.27(VSS4) U8.74(VSS2) U8.99(PDR_ON)
CAN_RX: J9.1 U8.70(PA11)
CAN_TX: J9.2 U8.71(PA12)
COL: U8.26(PA3) ; port COL
CRS: U8.23(PA0/WKUP) ; port CRS
EXT_UART_RX: J8.1 U8.69(PA10)
EXT_UART_TX: J8.2 U8.68(PA9)
nFAULT: U8.62(PD15) ; port nFAULT
nFAULT_2: U8.59(PD12) ; port nFAULT_2
NRST: C54.2 R33.1 SW3.2 U8.14(NRST) ; port NTJRST_F407
PHY_RESET: U8.64(PC7) ; port PHY_RESET
RESET_DAC: U8.54(PB15) ; port RESET_DAC
SNSO: U8.61(PD14) ; port SNSO
SNSO_2: U8.58(PD11) ; port SNSO_2
SO: U8.30(PA5) ; port SO
NetC56_1: C56.1 U8.12(PH0/OSC_IN) X2.2
NetC57_1: C57.1 U8.13(PH1/OSC_OUT) X2.1
NetC65_1: C65.1 U8.49(VCAP1)
NetC66_1: C66.1 U8.73(VCAP2)
NetC67_2: C67.2 C68.2 C69.2 C70.2 FB5.2 U8.21(VREF+) U8.22(VDDA)
NetR9_1: U8.25(PA2) ; port MDIO
NetR23_1: U8.45(PE14) ; port EN
NetR28_1: U8.93(PB7) ; port SDA
NetR29_1: U8.92(PB6) ; port SCL
NetR30_1: U8.55(PD8) ; port RESET
NetR34_2: R34.2 U8.37(PB2/BOOT1)
NetR35_2: R35.2 U8.94(BOOT0)
NetR47_1: U8.66(PC9) ; port EN_2
NetU1_18: U8.76(PA14_(JTCK/SWCLK)) ; port JTCLK_407
NetU1_25: U8.72(PA13) ; port JTMS_F407
NetU2_12: U8.16(PC1) ; port MDC
NetU2_13: U8.36(PB1) ; port RX_D3
NetU2_14: U8.35(PB0) ; port RX_D2
NetU2_15: U8.34(PC5) ; port RX_D1
NetU2_16: U8.33(PC4) ; port RX_D0
NetU2_18: U8.32(PA7) ; port RX_DV
NetU2_19: U8.24(PA1) ; port RX_CLK
NetU2_20: U8.47(PB10) ; port RX_ERR
NetU2_22: U8.18(PC3) ; port TX_CLK
NetU2_23: U8.48(PB11) ; port TX_EN
NetU2_24: U8.52(PB13) ; port TX_DO
NetU2_25: U8.51(PB12) ; port TX_D1
NetU2_26: U8.17(PC2) ; port TX_D2
NetU2_27: U8.1(PE2) ; port TX_D3
NetU3_15: U8.63(PC6) ; port PH
NetU4_2: U8.79(PC11) ; port CH340C_TXD
NetU4_3: U8.78(PC10) ; port CH340C_RXD
NetU4_14: U8.57(PD10) ; port CH340C_RST
NetU5_37: U8.29(PA4) ; port MCLK
NetU5_38: U8.89(PB3_(JTDO/_TRACESWO)) ; port SCLK
NetU5_39: U8.80(PC12) ; port SDIN
NetU5_40: U8.90(PB4_(NJTRST)) ; port LRCK
NetU6_3: U8.65(PC8) ; port CLK_MIC
NetU6_4: U8.53(PB14) ; port DOUT_MIC
NetU7_14: U8.56(PD9) ; port DRDY
NetU8_31: U8.31(PA6) ; port SO_2
NetU8_60: U8.60(PD13) ; port PH_2

Not connected (* = marked no-connect by the designer): U8 2(PE3)* 3(PE4)* 4(PE5)* 5(PE6)* 7(PC13)* 8(PC14/OSC32_IN)* 9(PC15/_OSC32_OUT)* 15(PC0)* 38(PE7)* 39(PE8)* 40(PE9)* 41(PE10)* 42(PE11)* 43(PE12)* 44(PE13)* 46(PE15)* 67(PA8)* 77(PA15_(JTDI))* 81(PD0)* 82(PD1)* 83(PD2)* 84(PD3)* 85(PD4)* 86(PD5)* 87(PD6)* 88(PD7)* 91(PB5)* 95(PB8)* 96(PB9)* 97(PE0)* 98(PE1)*

### Layout directives
net class Critical nets: NRST
net class OSC_Nets: (no net found under the mark)

### Notes on the sheet
- MCU
- Title
- Size:
- Date:
- A3
- Number:
- Time:
- Revision:
- Sheet
- of
- File:

### Library data of the parts
C54 C55 C58 C60-C64 C69-C71 = CAP_0.1uF-50V-5%-0805: as C2 on sheet [3]STM32F103_Debugger; Case/Package: 0805; Supplier-1: SIRICOM; Supplier Part Number-1: 0805B104J500CT
C56 C57 = CAP_30pF-50V-10%-0805: as C4 on sheet [3]STM32F103_Debugger; Case/Package: 0805; Supplier-1: Digikey; Supplier Part Number-1: 399-17443-1-ND - Cut Tape (CT)
C59 C67 C68 = CAP_1uF-50V-5%-0805: as C1 on sheet [3]STM32F103_Debugger; Case/Package: 0805; Supplier-1: SIRICOM; Supplier Part Number-1: CL21B105KBFNNNE
C65 C66 = CAP_2.2uF-25V-10%-0805: 2.2µF ±10% 25V Ceramic Capacitor X7R 0805 (2012 Metric) /; Manufacturer: KEMET; Manufacturer Part Number: CL21B225KAFNFNE; Alternate Part Number-1: NA; Case/Package: 0805; Supplier-1: SIRICOM; Supplier Part Number-1: CL21A225KAFNNNE
FB5 = FB_1K-100MHZ-1.6A-0805: as FB1 on sheet [4]Ethernet_PHY; Case/Package: 0805; Supplier-1: SIRICOM; Supplier Part Number-1: ACMS201209A102
J8 J9 = CON-PLG_4X1-50-ST-TH: 4 Pins, 1 Row 1.25mm Pitch, straight Connector, male; Manufacturer: JST; Mating Part Number: 653004113322; Crimp Part Number: 653153128130; Alternate Part Number-1: NA; Manufacturer Part Number: 653004114822; Case/Package: TH-CON; Supplier-1: WURTH; Supplier Part Number-1: 653004114822
R33 = RES_10K-0.125W-1%-0805: as R3 on sheet [3]STM32F103_Debugger; Case/Package: 0805; Supplier-1: SIRICOM; Supplier Part Number-1: WR08X1002FTL; Alternate Part Number-1: WR08X1002FTL
R34 R35 = RES_100K-0.125W-1%-0805: as R1 on sheet [3]STM32F103_Debugger; Case/Package: 0805; Supplier-1: SIRICOM; Supplier Part Number-1: WR08X1003FTL
SW3 = SW1_RS-282G05A3-SMRT-SMD: as SW1 on sheet [3]STM32F103_Debugger; Manufacturer Part Number: RS-282G05A3-SMRT; Case/Package: SMD; Supplier-1: SP ROAD; Supplier Part Number-1: RS-282G05A3-SMRT
U8 = IC_STM32F407VGT6: ARM® Cortex®-M4 STM32F4 Microcontroller IC 32-Bit 168MHz 1MB (1M x 8) FLASH 100-LQFP (14x14) /; Manufacturer: STMicroelectronics; Alternate Part Number-1: STM32F407VET6; Manufacturer Part Number: STM32F407VGT6; Case/Package: LQFP100; Supplier-1: ARROW; Supplier Part Number-1: STM32F407VGT6
X2 = XTAL_8MHZ-ECS-80-32-5PX-SMD: as X1 on sheet [3]STM32F103_Debugger; Case/Package: SMD/SMT; Supplier-1: SP ROAD; Supplier Part Number-1: ECS-80-32-5PX-TR

## Sheet [10]Motor_Driver_2.SchDoc
size A3; DocumentNumber: 10; SheetNumber: 10; SheetTotal: 11
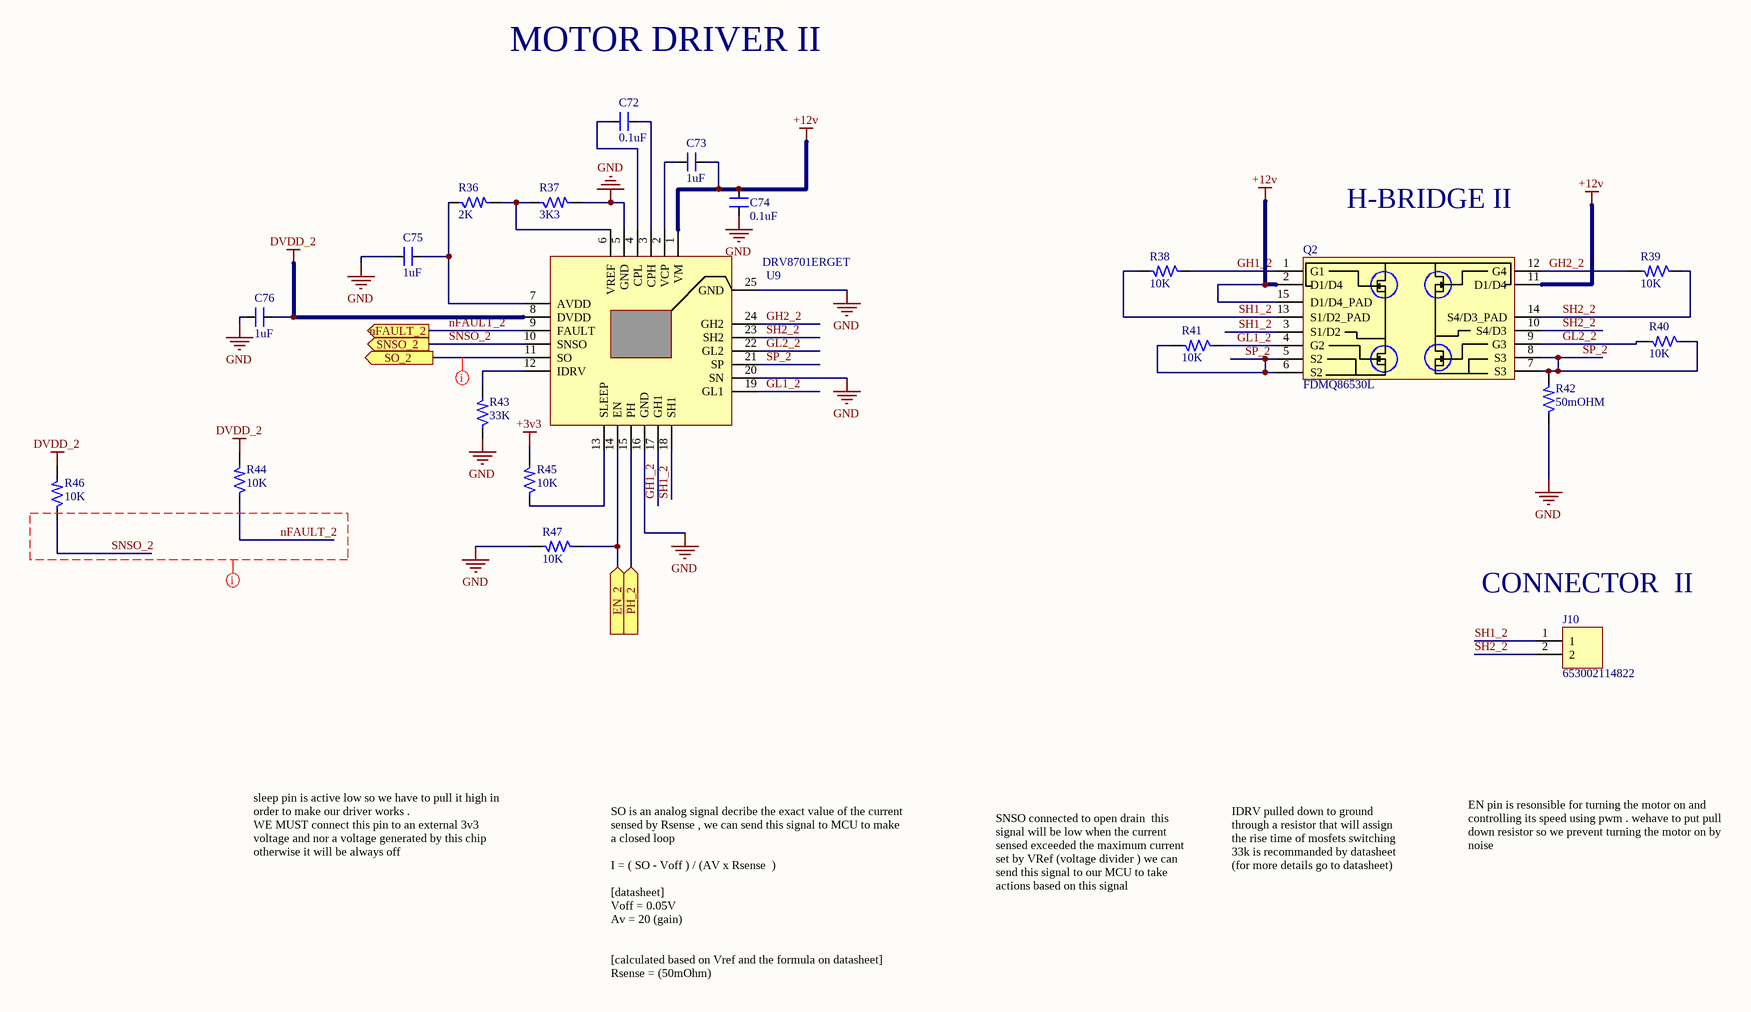
[diagram p19: [10]Motor_Driver_2.SchDoc]

### Parts
C72  0.1uF  [CAP_0805]
C73  1uF  [CAP_0805]
C74  0.1uF  [CAP_0805]
C75  1uF  [CAP_0805]
C76  1uF  [CAP_0805]
J10  653002114822  [CON2_50_653002114822_TH_ST]
Q2  FDMQ86530L  [DFN5045-12_33_212_27X15_SMD_1]
R36  2K  [RES_0805]
R37  3K3  [RES_0603]
R38  10K  [RES_0805]
R39  10K  [RES_0805]
R40  10K  [RES_0805]
R41  10K  [RES_0805]
R42  50mOHM  [RES_2512]
R43  33K  [RES_0805]
R44  10K  [RES_0805]
R45  10K  [RES_0805]
R46  10K  [RES_0805]
R47  10K  [RES_0805]
U9  DRV8701ERGET  [VFQFN24_19.6_196_12X32_SMD_1]

### Ports
EN_2 (in), nFAULT_2 (out), PH_2 (in), SNSO_2 (out), SO_2 (out)

### Nets
+3v3: R45.2
+12v: C73.2 C74.2 Q2.2(D1/D4) Q2.11(D1/D4) Q2.15(D1/D4_PAD) U9.1(VM)
DVDD_2: C76.2 R44.2 R46.2 U9.8(DVDD)
GND: C74.1 C75.1 C76.1 R37.2 R42.1 R43.1 R47.2 U9.5(GND) U9.16(GND) U9.20(SN) U9.25(GND)
GH1_2: Q2.1(G1) R38.1 U9.17(GH1)
GH2_2: Q2.12(G4) R39.2 U9.24(GH2)
GL1_2: Q2.4(G2) R41.1 U9.19(GL1)
GL2_2: Q2.9(G3) R40.2 U9.22(GL2)
nFAULT_2: R44.1 U9.9(FAULT) ; port nFAULT_2
SH1_2: J10.1 Q2.3(S1/D2) Q2.13(S1/D2_PAD) R38.2 U9.18(SH1)
SH2_2: J10.2 Q2.10(S4/D3) Q2.14(S4/D3_PAD) R39.1 U9.23(SH2)
SNSO_2: R46.1 U9.10(SNSO) ; port SNSO_2
SP_2: Q2.5(S2) Q2.6(S2) Q2.7(S3) Q2.8(S3) R40.1 R41.2 R42.2 U9.21(SP)
NetC72_1: C72.1 U9.4(CPL)
NetC72_2: C72.2 U9.3(CPH)
NetC73_1: C73.1 U9.2(VCP)
NetC75_2: C75.2 R36.1 U9.7(AVDD)
NetR36_2: R36.2 R37.1 U9.6(VREF)
NetR43_2: R43.2 U9.12(IDRV)
NetR45_1: R45.1 U9.13(SLEEP)
NetR47_1: R47.1 U9.14(EN) ; port EN_2
NetU8_31: U9.11(SO) ; port SO_2
NetU8_60: U9.15(PH) ; port PH_2

### Layout directives
net class Critical nets: NetU8_31, nFAULT_2, SNSO_2

### Notes on the sheet
- MOTOR DRIVER II
- H-BRIDGE II
- (near J10) CONNECTOR  II
- sleep pin is active low so we have to pull it high in order to make our driver works .
  WE MUST connect this pin to an external 3v3 voltage and nor a voltage generated by this chip otherwise it will be always off
- SNSO connected to open drain  this signal will be low when the current sensed exceeded the maximum current set by VRef (voltage divider ) we can send this signal to our MCU to take actions based on this signal
- IDRV pulled down to ground through a resistor that will assign the rise time of mosfets switching
  33k is recommanded by datasheet
  (for more details go to datasheet)
- EN pin is resonsible for turning the motor on and controlling its speed using pwm . wehave to put pull down resistor so we prevent turning the motor on by noise
- SO is an analog signal decribe the exact value of the current  sensed by Rsense , we can send this signal to MCU to make a closed loop
  I = ( SO - Voff ) / (AV x Rsense  )
  [datasheet]
  Voff = 0.05V
  Av = 20 (gain)
  [calculated based on Vref and the formula on datasheet]
  Rsense = (50mOhm)
- Title
- Size:
- Date:
- A3
- Number:
- Time:
- Revision:
- Sheet
- of
- File:

### Library data of the parts
C72 C74 = CAP_0.1uF-50V-5%-0805: as C2 on sheet [3]STM32F103_Debugger; Case/Package: 0805; Supplier-1: SIRICOM; Supplier Part Number-1: 0805B104J500CT
C73 C75 C76 = CAP_1uF-50V-5%-0805: as C1 on sheet [3]STM32F103_Debugger; Case/Package: 0805; Supplier-1: SIRICOM; Supplier Part Number-1: CL21B105KBFNNNE
J10 = CON-PLG_2X1-50-ST-TH: as J4 on sheet [5]Motor_Driver; Manufacturer Part Number: 653002114822; Case/Package: TH-CON; Supplier-1: WURTH; Supplier Part Number-1: 653002114822
Q2 = MOSFET-N_60V-8A-V-DFN5045-12: as Q1 on sheet [5]Motor_Driver; Manufacturer Part Number: FDMQ86530L; Case/Package: DFN5045-12; Supplier-1: Arrow; Supplier Part Number-1: FDMQ86530L
R36 = RES_2K-0.125W-1%-0805: as R12 on sheet [5]Motor_Driver; Case/Package: 0805; Supplier-1: SIRICOM; Supplier Part Number-1: WR08X2001FTL
R37 = RES_3.3K-0.1W-1%-0603: as R13 on sheet [5]Motor_Driver; Case/Package: 0603; Supplier-1: SIRICOM; Supplier Part Number-1: WR06X3301FTL
R38-R41 R44-R47 = RES_10K-0.125W-1%-0805: as R3 on sheet [3]STM32F103_Debugger; Case/Package: 0805; Supplier-1: SIRICOM; Supplier Part Number-1: WR08X1002FTL; Alternate Part Number-1: WR08X1002FTL
R42 = RES_50mOhm-2W-1%-2512: as R18 on sheet [5]Motor_Driver; Case/Package: 2512; Supplier-1: SIRICOM; Supplier Part Number-1: LR2512-22R060F1
R43 = RES_33K-0.125W-1%-0805: as R19 on sheet [5]Motor_Driver; Case/Package: 0805; Supplier-1: SIRICOM; Supplier Part Number-1: WR08X3302FTL
U9 = IC_DRV8701ERGET: as U3 on sheet [5]Motor_Driver; Manufacturer Part Number: DRV8701ERGET; Case/Package: VFQFN24; Supplier-1: ARROW; Supplier Part Number-1: DRV8701ERGET

## Sheet [11]power_input_and_regualtors.SchDoc
size A3; DocumentNumber: 11; SheetNumber: 11; SheetTotal: 11
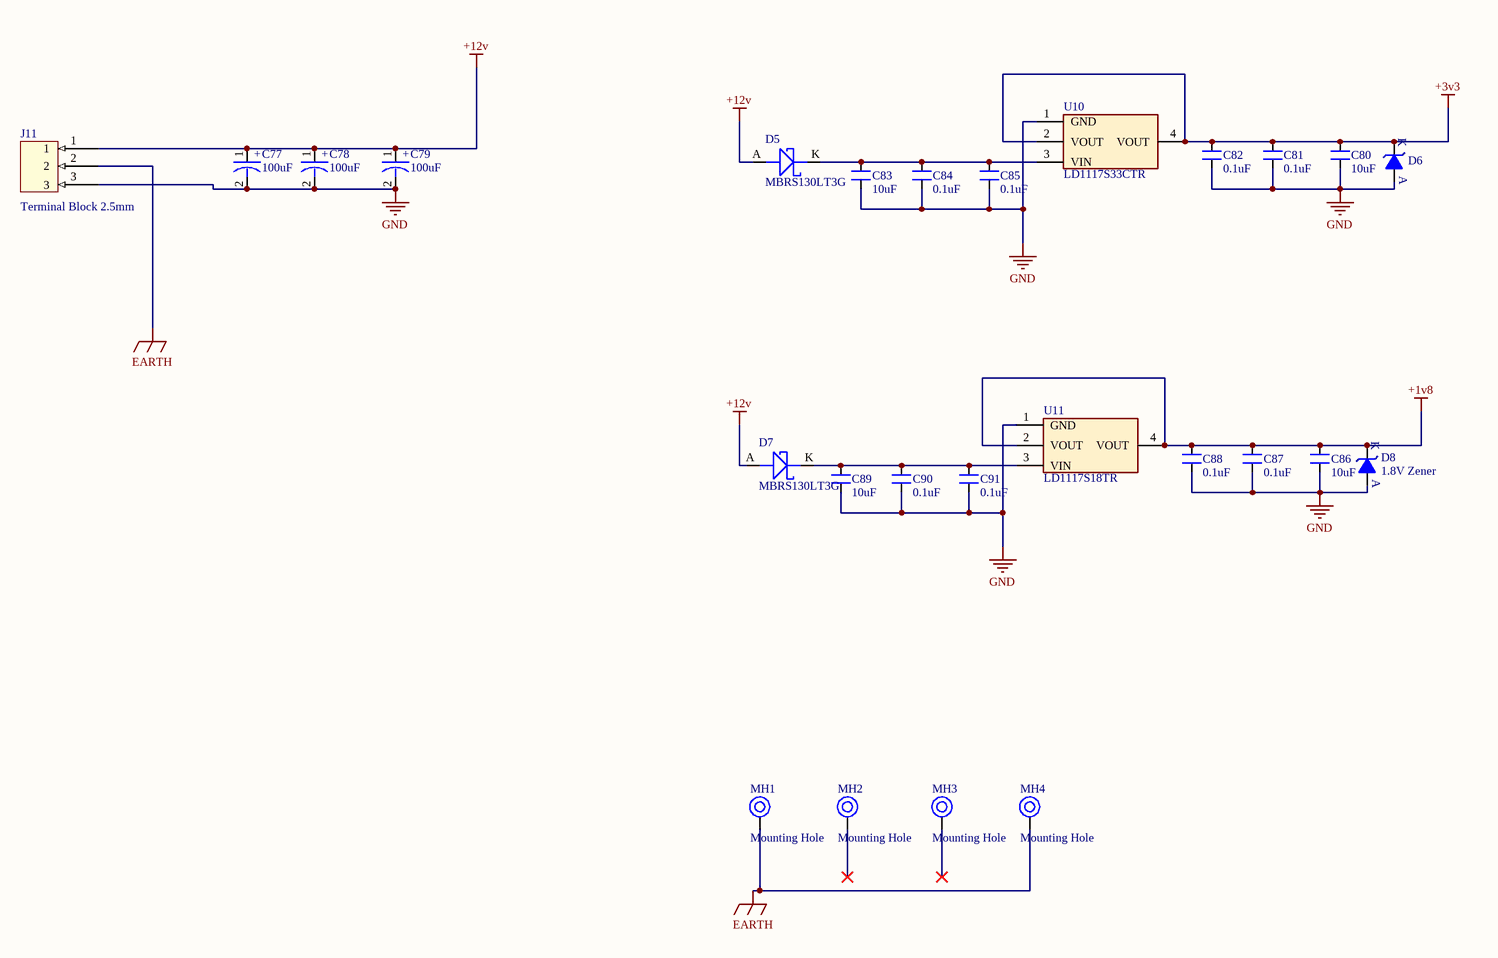
[diagram p20: [11]power_input_and_regualtors.SchDoc]

### Parts
C77  100uF  [ACAP_P305_D393_H393_RAD]
C78  100uF  [ACAP_P305_D393_H393_RAD]
C79  100uF  [ACAP_P305_D393_H393_RAD]
C80  10uF  [CAP_1206]
C81  0.1uF  [CAP_0805]
C82  0.1uF  [CAP_0805]
C83  10uF  [CAP_1206]
C84  0.1uF  [CAP_0805]
C85  0.1uF  [CAP_0805]
C86  10uF  [CAP_1206]
C87  0.1uF  [CAP_0805]
C88  0.1uF  [CAP_0805]
C89  10uF  [CAP_1206]
C90  0.1uF  [CAP_0805]
C91  0.1uF  [CAP_0805]
D5  MBRS130LT3G  [DIO_SMB_DO-214AA]
D6  BZT52C3V3-7-F  [DIO_SOD-123]  (value not drawn)
D7  MBRS130LT3G  [DIO_SMB_DO-214AA]
D8  1.8V Zener  [DIO_DO-213AB_SMD]
J11  Terminal Block 2.5mm  [CON3_100_TB_TH_ST]
MH1  Mounting Hole  [MOUNTING]
MH2  Mounting Hole  [MOUNTING]
MH3  Mounting Hole  [MOUNTING]
MH4  Mounting Hole  [MOUNTING]
U10  LD1117S33CTR  [SOT223_3]
U11  LD1117S18TR  [SOT223_3]

### Nets
+1v8: C86.2 C87.2 C88.2 D8.K U11.2(VOUT) U11.4(VOUT)
+3v3: C80.2 C81.2 C82.2 D6.K U10.2(VOUT) U10.4(VOUT)
+12v: C77.1 C78.1 C79.1 D5.A D7.A J11.1
EARTH: J11.2 MH1.1 MH4.1
GND: C77.2 C78.2 C79.2 C80.1 C81.1 C82.1 C83.1 C84.1 C85.1 C86.1 C87.1 C88.1 C89.1 C90.1 C91.1 D6.A D8.A J11.3 U10.1(GND) U11.1(GND)
NetC83_2: C83.2 C84.2 C85.2 D5.K U10.3(VIN)
NetC89_2: C89.2 C90.2 C91.2 D7.K U11.3(VIN)

Not connected (* = marked no-connect by the designer): MH2 1*; MH3 1*

### Notes on the sheet
- Title
- Size:
- Date:
- A3
- Number:
- Time:
- Revision:
- Sheet
- of
- File:
- (in symbol CAP-P_100uF-50V-20%-RAD) +

### Library data of the parts
C77-C79 = CAP-P_100uF-50V-20%-RAD: as C6 on sheet [5]Motor_Driver; Case/Package: Radial-SMD; Supplier-1: SP ROAD; Supplier Part Number-1: GYA1H101MCQ1GS
C80 C83 C86 C89 = CAP_10uF-50V-10%-1206: as C13 on sheet [4]Ethernet_PHY; Case/Package: 1206; Supplier-1: SIRICOM; Supplier Part Number-1: CC1206KKX5R9BB106
C81 C82 C84 C85 C87 C88 C90 C91 = CAP_0.1uF-50V-5%-0805: as C2 on sheet [3]STM32F103_Debugger; Case/Package: 0805; Supplier-1: SIRICOM; Supplier Part Number-1: 0805B104J500CT
D5 D7 = DIO-S_445mV-30V-2A-SMB: Diode Schottky 30V 2A Surface Mount SMB; Manufacturer: ON Semiconductor; Alternate Part Number-1: NA; Manufacturer Part Number: MBRS130LT3G; Case/Package: SMB; Supplier-1: ARROW; Supplier Part Number-1: MBRS130LT3G
D6 = DIO-Z_3.3V-500mW-SOD123: Zener Diode 3.3V 500mW ±6% Surface Mount SOD-123 /; Manufacturer: Diodes Incorporated; Alternate Part Number-1: NA; Manufacturer Part Number: BZT52C3V3-7-F; Case/Package: SOD-123; Supplier-1: Digikey; Supplier Part Number-1: BZT52C3V3-FDICT-ND
D8 = DIO-Z_1.8V-500mW-DO213AA: Zener Diode 1.8V 500mW ±5% Surface Mount DO-213AA /; Manufacturer: *; Manufacturer Part Number: *; Case/Package: *; Supplier-1: *; Supplier Part Number-1: *; Alternate Part Number-1: *
J11 = CON-TB_3X1-100-ST-TH: 3 Pins, 1 Row 2.54mm Pitch, straight Connector, male; Manufacturer Part Number: 1725669; Manufacturer: Phoenix Contact; Alternate Part Number-1: NA; Case/Package: TH-CON; Supplier-1: SP ROAD; Supplier Part Number-1: 1725669
MH1-MH4 = MH_3.5H_6D: Manufacturer Part Number: NA; Case/Package: TH; Manufacturer: NA; Supplier-1: NA; Supplier Part Number-1: NA; Alternate Part Number-1: NA
U10 = REG_15V-3.3V-0.9A-12W-SOT223: Linear Voltage Regulator IC 1 Output 800mA SOT-223; Manufacturer: STMicroelectronics; Alternate Part Number-1: NA; Manufacturer Part Number: LD1117S33CTR; Case/Package: SOT223; Supplier-1: SP ROAD; Supplier Part Number-1: LD1117S33CTR
U11 = REG_15V-1.8V-0.8A-1.4W-SOT223: LDO Voltage Regulators 1.8V 0.8A Positive; Manufacturer: STMicroelectronics; Alternate Part Number-1: NA; Manufacturer Part Number: LD1117S18TR; Case/Package: SOT-223-3; Supplier-1: Mouser; Supplier Part Number-1: 511-LD1117S18-TR